# EAGLE design transponder-5.0 (EAGLE 9.6.1)

## Sheet 1 of 7
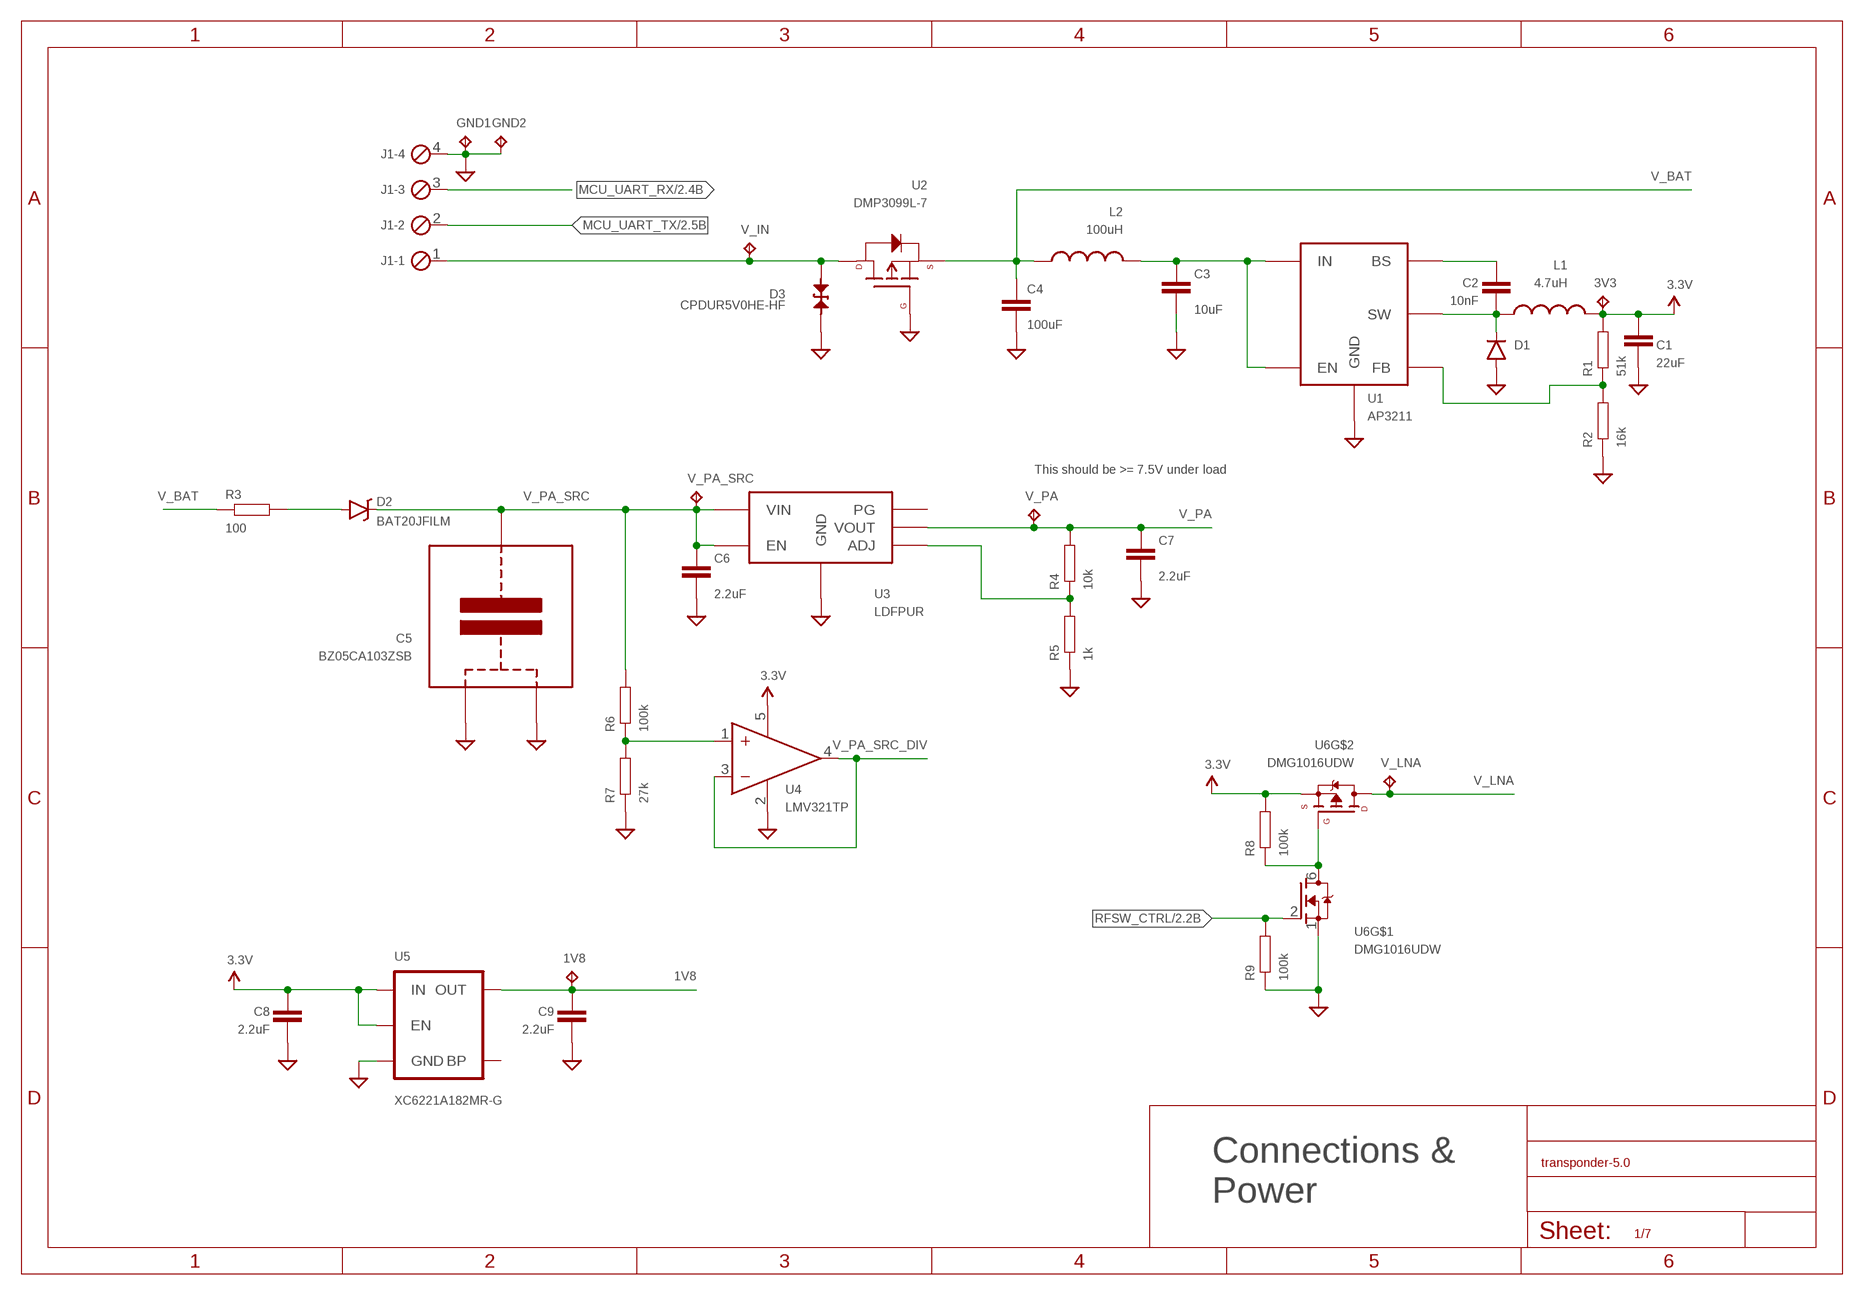
[diagram p0: schematic, sheet 1]

### Parts
1V8  TPTP12R  [TP12R]
3V3  TPTP12R  [TP12R]
C1  22uF  CAP0805  [0805]
C2  10nF  CAP0603-CAP  [0603-CAP]
C3  10uF  CAP0805  [0805]
C4  100uF  CAP1210  [1210]
C5  BZ05CA103ZSB  [BZ05]
C6  2.2uF  CAP0603-CAP  [0603-CAP]
C7  2.2uF  CAP0603-CAP  [0603-CAP]
C8  2.2uF  CAP0603-CAP  [0603-CAP]
C9  2.2uF  CAP0603-CAP  [0603-CAP]
D1  DIODESOD123  [SOD-123]
D2  BAT20JFILM  [SOD-323]
D3  CPDUR5V0HE-HF  [0603]
GND1  TPTP12R  [TP12R]
GND2  TPTP12R  [TP12R]
J1  MPT4  [4POL254]
L1  4.7uH  INDUCTOR0805  [0805]
L2  100uH  INDUCTOR1007  [1007]
R1  51k  RESISTOR0603-RES  [0603-RES]
R2  16k  RESISTOR0603-RES  [0603-RES]
R3  100  RESISTOR0603-RES  [0603-RES]
R4  10k  RESISTOR0603-RES  [0603-RES]
R5  1k  RESISTOR0603-RES  [0603-RES]
R6  100k  RESISTOR0603-RES  [0603-RES]
R7  27k  RESISTOR0603-RES  [0603-RES]
R8  100k  RESISTOR0603-RES  [0603-RES]
R9  100k  RESISTOR0603-RES  [0603-RES]
U1  AP3211  [SOT23-6]
U2  DMP3099L-7  P-CHANNEL-MOSFET  [SOT23-3]
U3  LDFPUR  LDF  [DFN-6]
U4  LMV321TP  [SOT23-5]
U5  XC6221A182MR-G  V_REG_LDOSMD  [SOT23-5]
U6  DMG1016UDW  [SOT363]
V_IN  TPTP12R  [TP12R]
V_LNA  TPTP12R  [TP12R]
V_PA  TPTP12R  [TP12R]
V_PA_SRC  TPTP12R  [TP12R]

### Nets
1V8: 1V8.TP C9.1 U5.5(OUT) ; also sheet 6
3.3V: 3V3.TP C1.1 C8.1 L1.2 R1.2 R8.2 U4.5(V+) U5.1(IN) U5.3(EN) U6.4(S) ; also sheet 2,4,6,7
GND: C1.2 C3.2 C4.2 C5.P$1 C5.P$2 C6.2 C7.2 C8.2 C9.2 D1.A D3.2 GND1.TP GND2.TP J1.4 R2.1 R5.1 R7.1 R9.1 U1.2(GND) U2.1(G) U3.P$4(GND) U3.P$7(GND) U4.2(V-) U5.2(GND) U6.1(S) ; also sheet 2,3,4,5,6,7
MCU_UART_RX: J1.3 ; also sheet 2
MCU_UART_TX: J1.2 ; also sheet 2
N$1: C3.1 L2.2 U1.4(EN) U1.5(IN)
N$2: C2.2 D1.C L1.1 U1.6(SW)
N$3: D2.A R3.2
N$4: C2.1 U1.1(BS)
N$5: R1.1 R2.2 U1.3(FB)
N$6: R8.1 U6.5(G) U6.6(D)
N$7: R6.1 R7.2 U4.1(IN+)
N$9: R4.1 R5.2 U3.P$2(ADJ)
RFSW_CTRL: R9.2 U6.2(G) ; also sheet 2,7
V_BAT: C4.1 L2.1 R3.1 U2.2(S)
V_IN: D3.1 J1.1 U2.3(D) V_IN.TP
V_LNA: U6.3(D) V_LNA.TP ; also sheet 3
V_PA: C7.1 R4.2 U3.P$1(VOUT) V_PA.TP ; also sheet 5
V_PA_SRC: C5.P$3 C6.1 D2.C R6.2 U3.P$5(EN) U3.P$6(VIN) V_PA_SRC.TP
V_PA_SRC_DIV: U4.3(IN-) U4.4(OUT) ; also sheet 2
Unconnected: U3.P$3(PG) U5.4(BP)

### Notes on the sheet
- This should be >= 7.5V under load
- Connections &
  Power

## Sheet 2 of 7
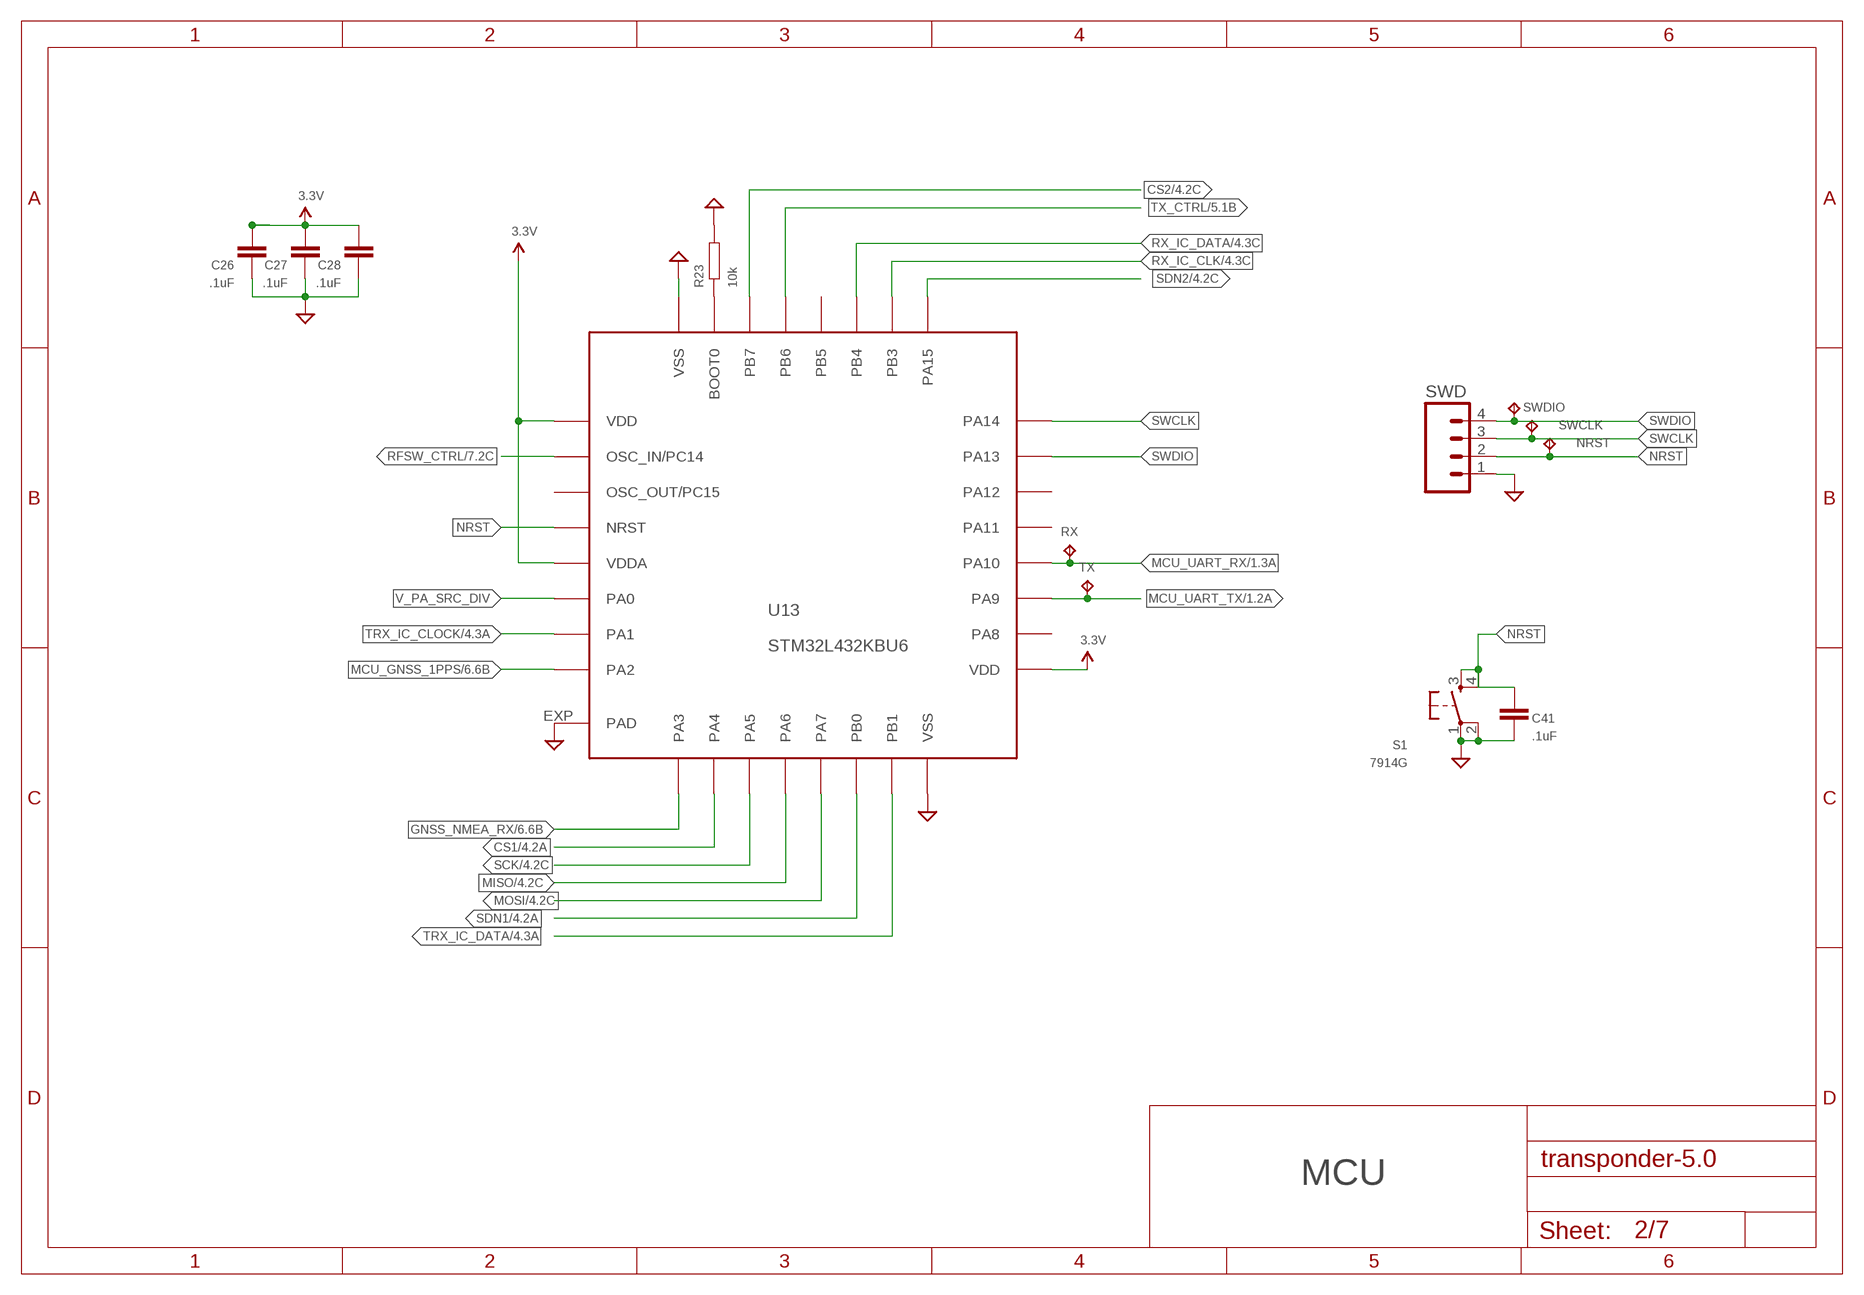
[diagram p1: schematic, sheet 2]

### Parts
C26  .1uF  CAP0603-CAP  [0603-CAP]
C27  .1uF  CAP0603-CAP  [0603-CAP]
C28  .1uF  CAP0603-CAP  [0603-CAP]
C41  .1uF  CAP0603-CAP  [0603-CAP]
NRST  TPTP12R  [TP12R]
R23  10k  RESISTOR0603-RES  [0603-RES]
RX  TPTP12R  [TP12R]
S1  7914G  TACTILE-SWITCH-7914G  [7914G]
SWCLK  TPTP12R  [TP12R]
SWD  M04PTH  [1X04]
SWDIO  TPTP12R  [TP12R]
TX  TPTP12R  [TP12R]
U13  STM32L432KBU6  STM32L432KXXX  [QFN32]

### Nets
3.3V: C26.1 C27.1 C28.1 U13.1(VDD) U13.5(VDDA) U13.17(VDD) ; also sheet 1,4,6,7
CS1: U13.10(PA4) ; also sheet 4
CS2: U13.30(PB7) ; also sheet 4
GND: C26.2 C27.2 C28.2 C41.2 R23.2 S1.1 S1.2 SWD.1 U13.16(VSS) U13.32(VSS) U13.EXP(PAD) ; also sheet 1,3,4,5,6,7
GNSS_NMEA_RX: U13.9(PA3) ; also sheet 6
MCU_GNSS_1PPS: U13.8(PA2) ; also sheet 6
MCU_UART_RX: RX.TP U13.20(PA10) ; also sheet 1
MCU_UART_TX: TX.TP U13.19(PA9) ; also sheet 1
MISO: U13.12(PA6) ; also sheet 4
MOSI: U13.13(PA7) ; also sheet 4
N$36: R23.1 U13.31(BOOT0)
NRST: C41.1 NRST.TP S1.3 S1.4 SWD.2 U13.4(NRST)
RFSW_CTRL: U13.2(OSC_IN/PC14) ; also sheet 1,7
RX_IC_CLK: U13.26(PB3) ; also sheet 4
RX_IC_DATA: U13.27(PB4) ; also sheet 4
SCK: U13.11(PA5) ; also sheet 4
SDN1: U13.14(PB0) ; also sheet 4
SDN2: U13.25(PA15) ; also sheet 4
SWCLK: SWCLK.TP SWD.3 U13.24(PA14)
SWDIO: SWD.4 SWDIO.TP U13.23(PA13)
TRX_IC_CLOCK: U13.7(PA1) ; also sheet 4
TRX_IC_DATA: U13.15(PB1) ; also sheet 4
TX_CTRL: U13.29(PB6) ; also sheet 5
V_PA_SRC_DIV: U13.6(PA0) ; also sheet 1
Unconnected: U13.3(OSC_OUT/PC15) U13.18(PA8) U13.21(PA11) U13.22(PA12) U13.28(PB5)

### Notes on the sheet
- MCU

## Sheet 3 of 7
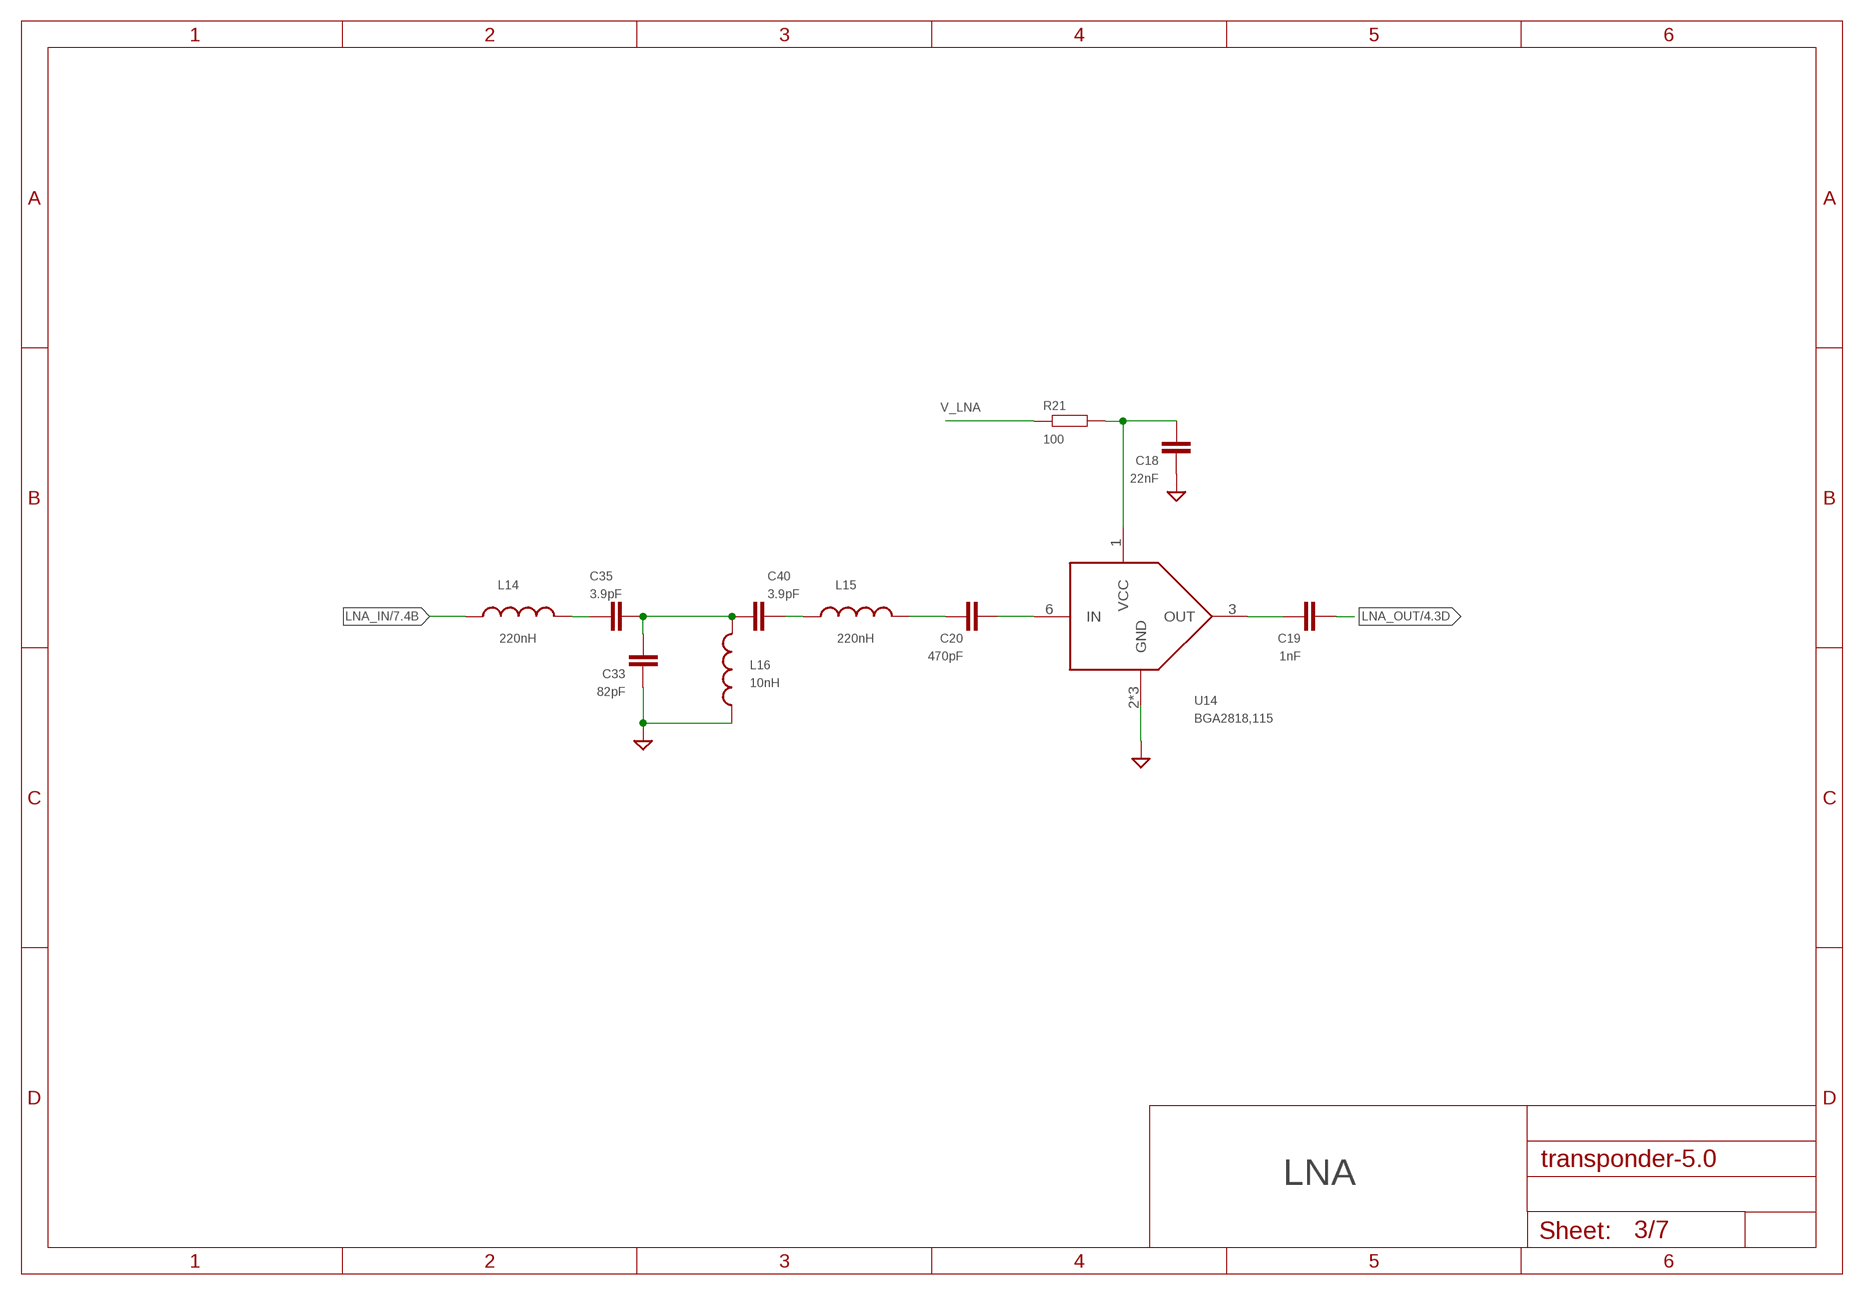
[diagram p2: schematic, sheet 3]

### Parts
C18  22nF  CAP0603-CAP  [0603-CAP]
C19  1nF  CAP0603-CAP  [0603-CAP]
C20  470pF  CAP0603-CAP  [0603-CAP]
C33  82pF  CAP0603-CAP  [0603-CAP]
C35  3.9pF  CAP0603-CAP  [0603-CAP]
C40  3.9pF  CAP0603-CAP  [0603-CAP]
L14  220nH  INDUCTOR0603  [0603]
L15  220nH  INDUCTOR0603  [0603]
L16  10nH  INDUCTOR0603  [0603]
R21  100  RESISTOR0603-RES  [0603-RES]
U14  BGA2818,115  BGA2870  [SOT363]

### Nets
GND: C18.2 C33.1 L16.1 U14.2(GND) U14.4(GND) U14.5(GND) ; also sheet 1,2,4,5,6,7
LNA_IN: L14.1 ; also sheet 7
LNA_OUT: C19.2 ; also sheet 4
N$20: C20.2 U14.6(IN)
N$22: C18.1 R21.2 U14.1(VCC)
N$37: C33.2 C35.1 C40.2 L16.2
N$38: C40.1 L15.1
N$39: C35.2 L14.2
N$40: C20.1 L15.2
N$41: C19.1 U14.3(OUT)
V_LNA: R21.1 ; also sheet 1

### Notes on the sheet
- LNA

## Sheet 4 of 7
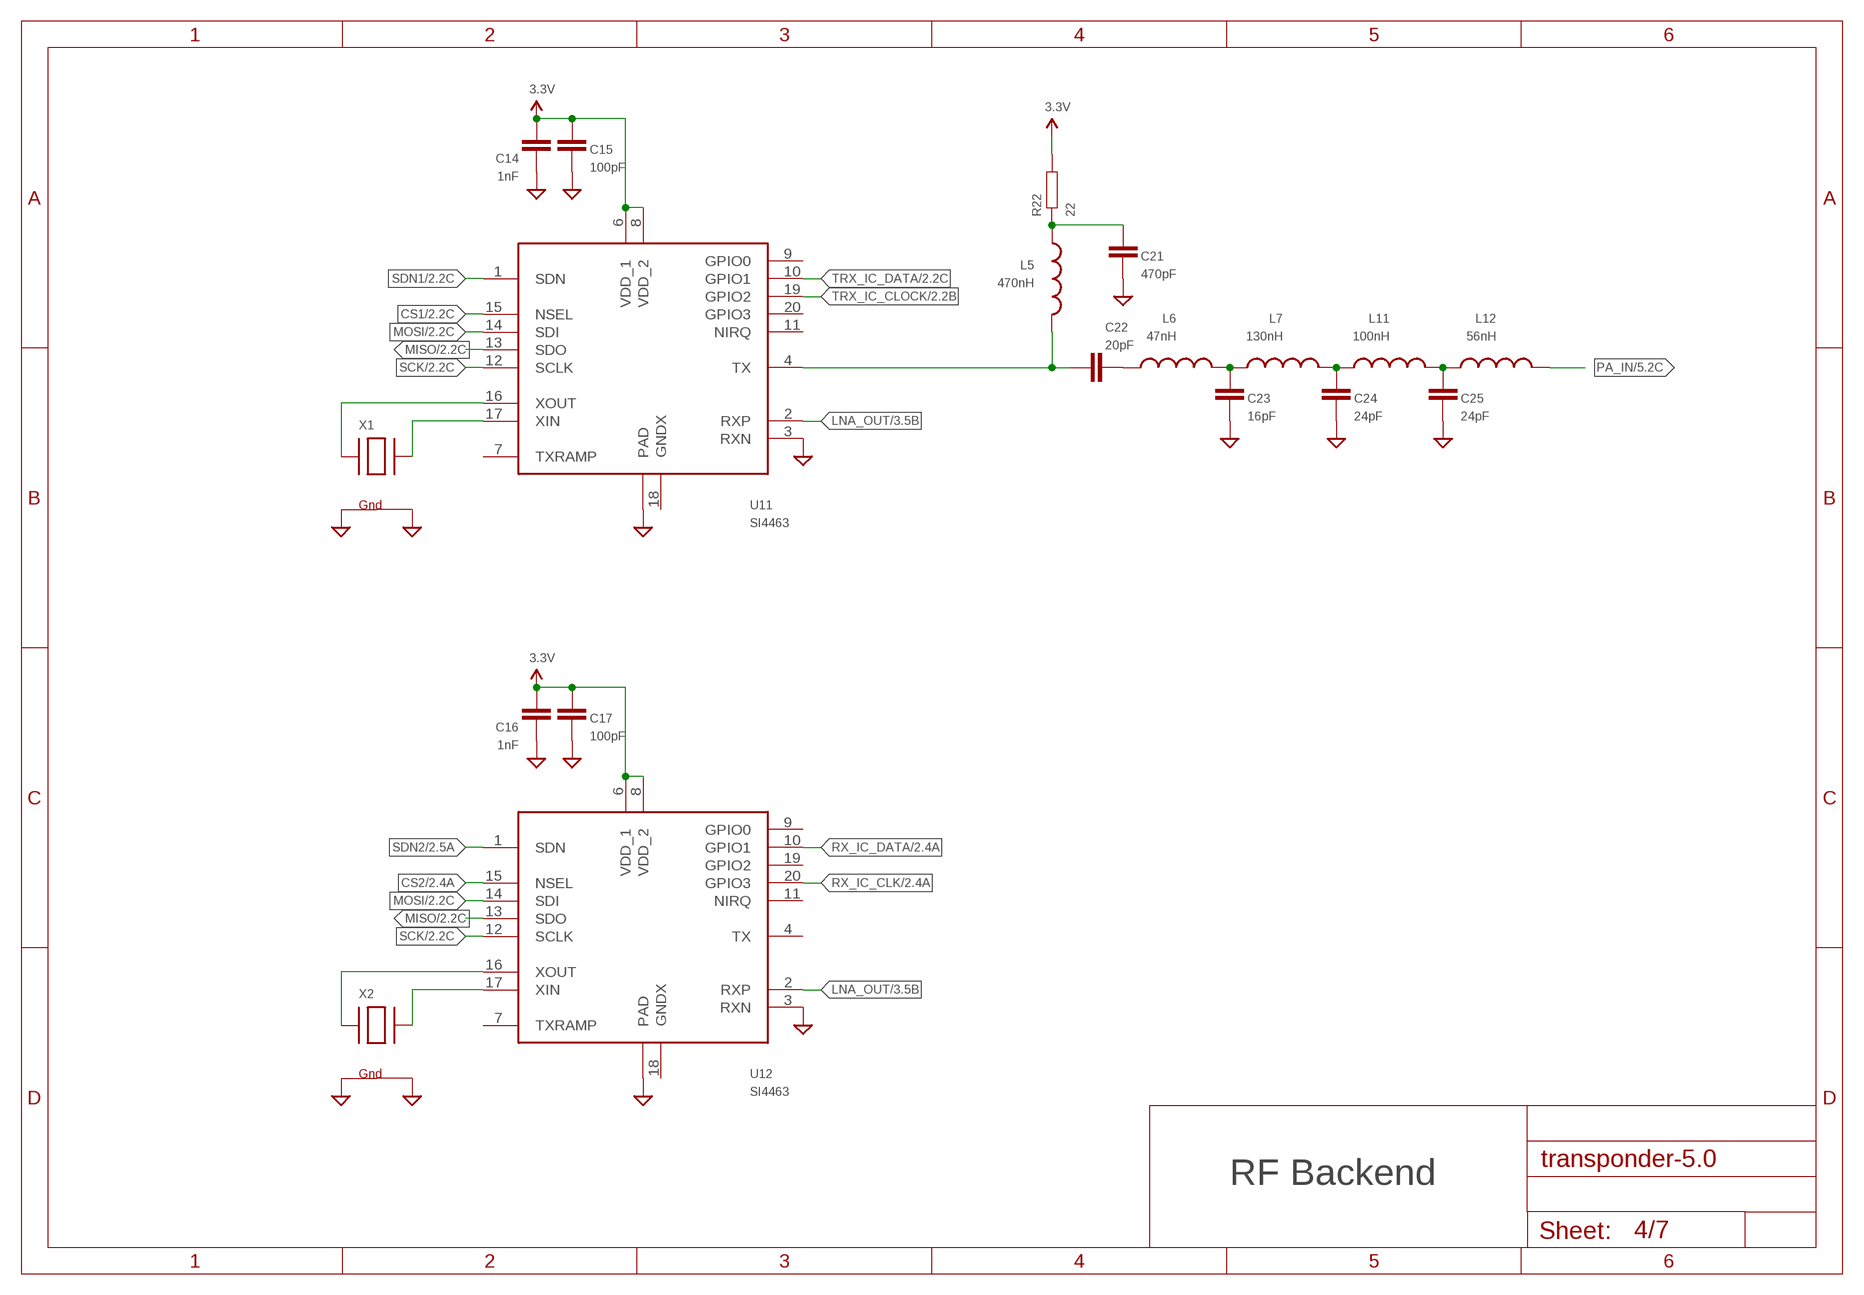
[diagram p3: schematic, sheet 4]

### Parts
C14  1nF  CAP0603-CAP  [0603-CAP]
C15  100pF  CAP0603-CAP  [0603-CAP]
C16  1nF  CAP0603-CAP  [0603-CAP]
C17  100pF  CAP0603-CAP  [0603-CAP]
C21  470pF  CAP0603-CAP  [0603-CAP]
C22  20pF  CAP0603-CAP  [0603-CAP]
C23  16pF  CAP0603-CAP  [0603-CAP]
C24  24pF  CAP0603-CAP  [0603-CAP]
C25  24pF  CAP0603-CAP  [0603-CAP]
L5  470nH  INDUCTOR0603  [0603]
L6  47nH  INDUCTOR0603  [0603]
L7  130nH  INDUCTOR0603  [0603]
L11  100nH  INDUCTOR0603  [0603]
L12  56nH  INDUCTOR0603  [0603]
R22  22  RESISTOR0603-RES  [0603-RES]
U11  SI4463  [SI4463]
U12  SI4463  [SI4463]
X1  XTAL-4-3225  [NX3225]
X2  XTAL-4-3225  [NX3225]

### Nets
3.3V: C14.1 C15.1 C16.1 C17.1 R22.2 U11.6(VDD_1) U11.8(VDD_2) U12.6(VDD_1) U12.8(VDD_2) ; also sheet 1,2,6,7
CS1: U11.15(NSEL) ; also sheet 2
CS2: U12.15(NSEL) ; also sheet 2
GND: C14.2 C15.2 C16.2 C17.2 C21.2 C23.2 C24.2 C25.2 U11.3(RXN) U11.EXP(PAD) U12.3(RXN) U12.EXP(PAD) X1.2(G2) X1.4(G1) X2.2(G2) X2.4(G1) ; also sheet 1,2,3,5,6,7
LNA_OUT: U11.2(RXP) U12.2(RXP) ; also sheet 3
MISO: U11.13(SDO) U12.13(SDO) ; also sheet 2
MOSI: U11.14(SDI) U12.14(SDI) ; also sheet 2
N$16: U12.16(XOUT) X2.1(X1)
N$17: U12.17(XIN) X2.3(X2)
N$18: U11.16(XOUT) X1.1(X1)
N$19: U11.17(XIN) X1.3(X2)
N$24: C22.1 L5.2 U11.4(TX)
N$30: C21.1 L5.1 R22.1
N$31: C22.2 L6.1
N$32: C23.1 L6.2 L7.1
N$33: C24.1 L7.2 L11.1
N$34: C25.1 L11.2 L12.1
PA_IN: L12.2 ; also sheet 5
RX_IC_CLK: U12.20(GPIO3) ; also sheet 2
RX_IC_DATA: U12.10(GPIO1) ; also sheet 2
SCK: U11.12(SCLK) U12.12(SCLK) ; also sheet 2
SDN1: U11.1(SDN) ; also sheet 2
SDN2: U12.1(SDN) ; also sheet 2
TRX_IC_CLOCK: U11.19(GPIO2) ; also sheet 2
TRX_IC_DATA: U11.10(GPIO1) ; also sheet 2
Unconnected: U11.7(TXRAMP) U11.9(GPIO0) U11.11(NIRQ) U11.18(GNDX) U11.20(GPIO3) U12.4(TX) U12.7(TXRAMP) U12.9(GPIO0) U12.11(NIRQ) U12.18(GNDX) U12.19(GPIO2)

### Notes on the sheet
- RF Backend

## Sheet 5 of 7
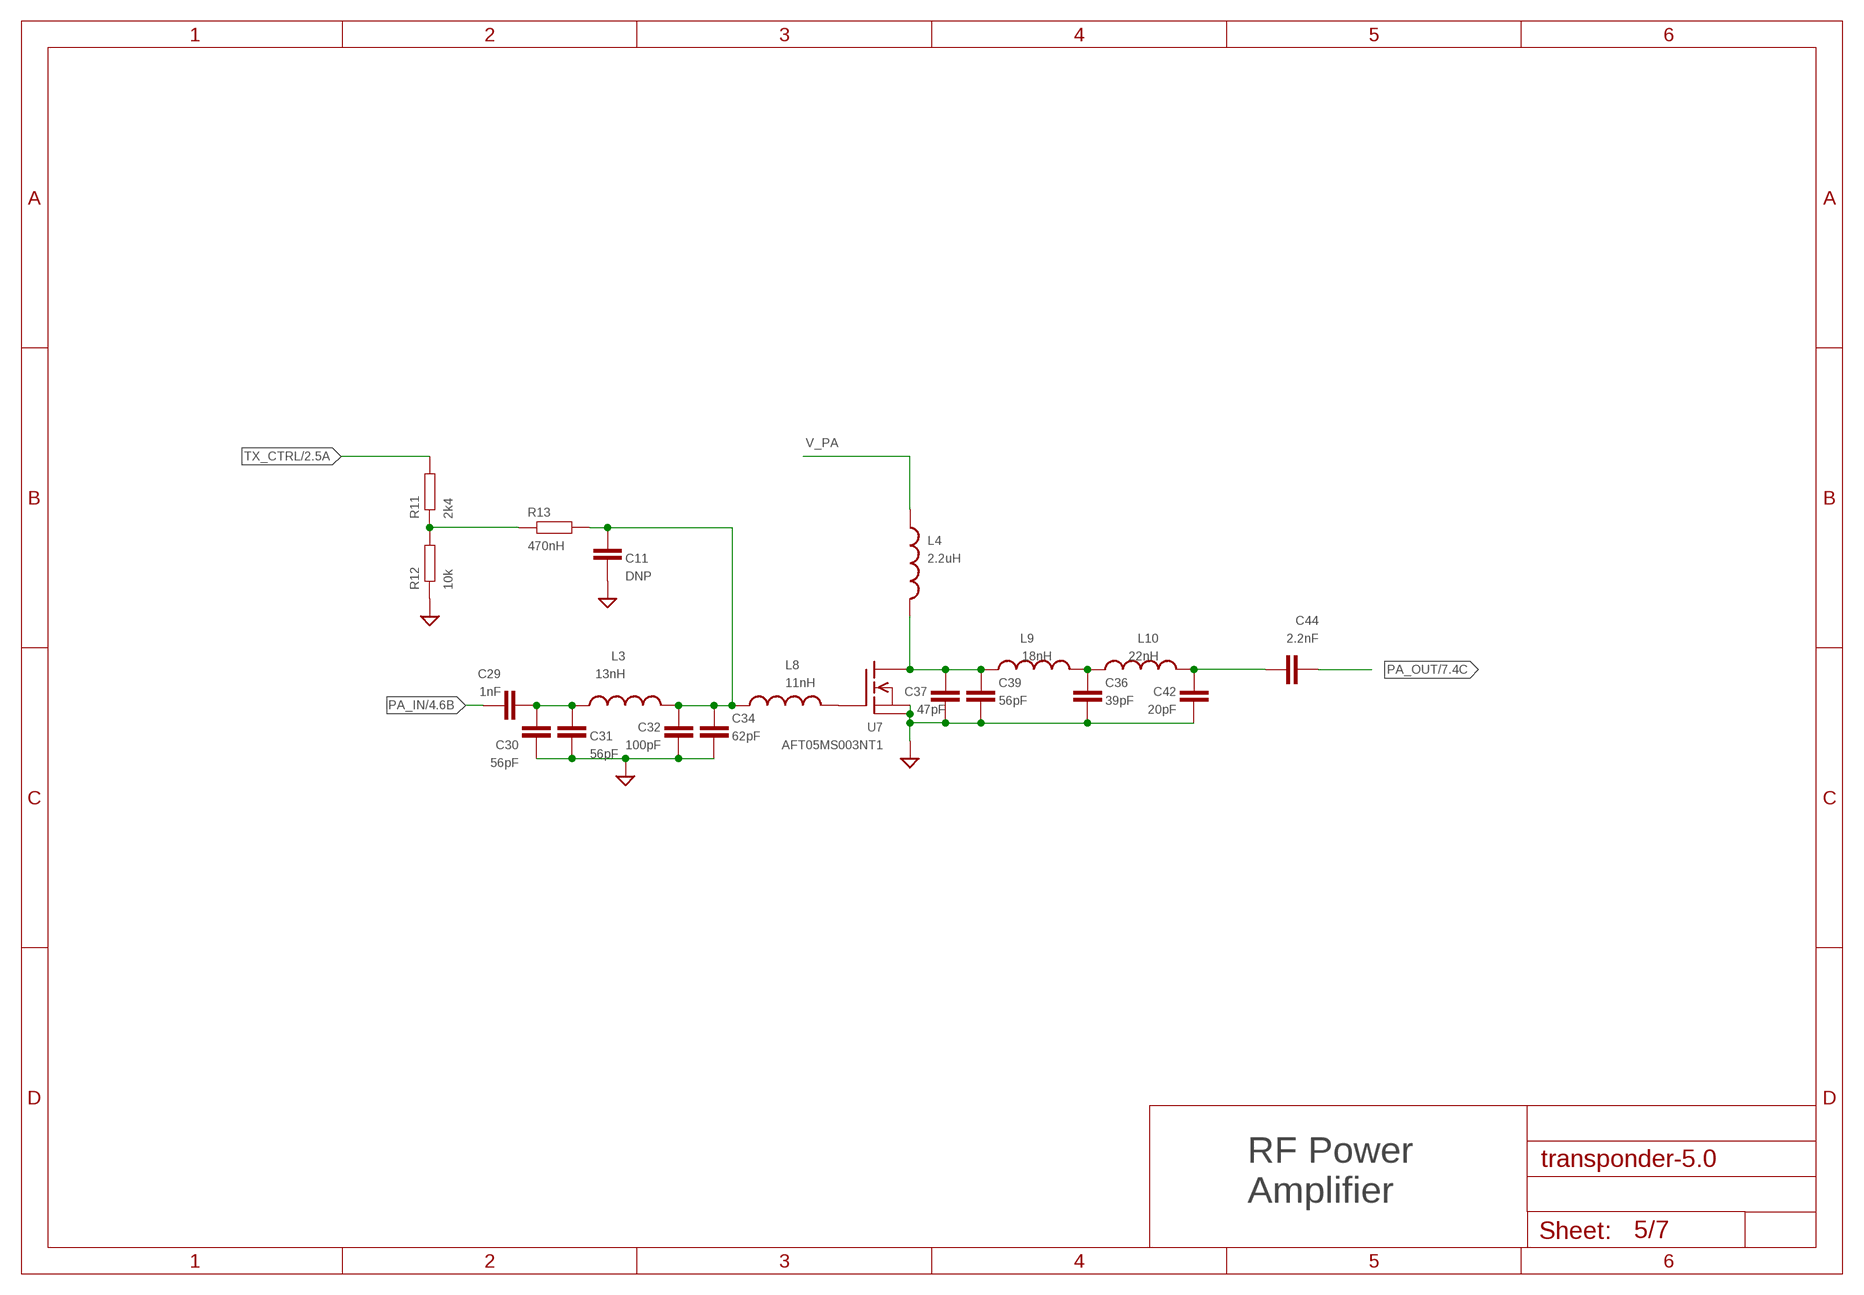
[diagram p4: schematic, sheet 5]

### Parts
C11  DNP  CAP0603-CAP  [0603-CAP]
C29  1nF  CAP0603-CAP  [0603-CAP]
C30  56pF  CAP0603-CAP  [0603-CAP]
C31  56pF  CAP0603-CAP  [0603-CAP]
C32  100pF  CAP0603-CAP  [0603-CAP]
C34  62pF  CAP0603-CAP  [0603-CAP]
C36  39pF  CAP0805  [0805]
C37  47pF  CAP0805  [0805]
C39  56pF  CAP0805  [0805]
C42  20pF  CAP0805  [0805]
C44  2.2nF  CAP0805  [0805]
L3  13nH  INDUCTOR0603  [0603]
L4  2.2uH  INDUCTOR0805  [0805]
L8  11nH  INDUCTOR0603  [0603]
L9  18nH  INDUCTOR0805  [0805]
L10  22nH  INDUCTOR0805  [0805]
R11  2k4  RESISTOR0603-RES  [0603-RES]
R12  10k  RESISTOR0603-RES  [0603-RES]
R13  470nH  RESISTOR0603-RES  [0603-RES]
U7  AFT05MS003NT1  AFT0SMS003N  [SOT-89]

### Nets
GND: C11.2 C30.2 C31.2 C32.2 C34.2 C36.2 C37.2 C39.2 C42.2 R12.1 U7.2(S) U7.2@1(PAD) ; also sheet 1,2,3,4,6,7
N$8: R11.1 R12.2 R13.1
N$23: C37.1 C39.1 L4.2 L9.1 U7.3(D)
N$25: L8.2 U7.1(G)
N$26: C11.1 C32.1 C34.1 L3.2 L8.1 R13.2
N$27: C29.2 C30.1 C31.1 L3.1
N$28: C36.1 L9.2 L10.1
N$43: C42.1 C44.1 L10.2
PA_IN: C29.1 ; also sheet 4
PA_OUT: C44.2 ; also sheet 7
TX_CTRL: R11.2 ; also sheet 2
V_PA: L4.1 ; also sheet 1

### Notes on the sheet
- RF Power
  Amplifier

## Sheet 6 of 7
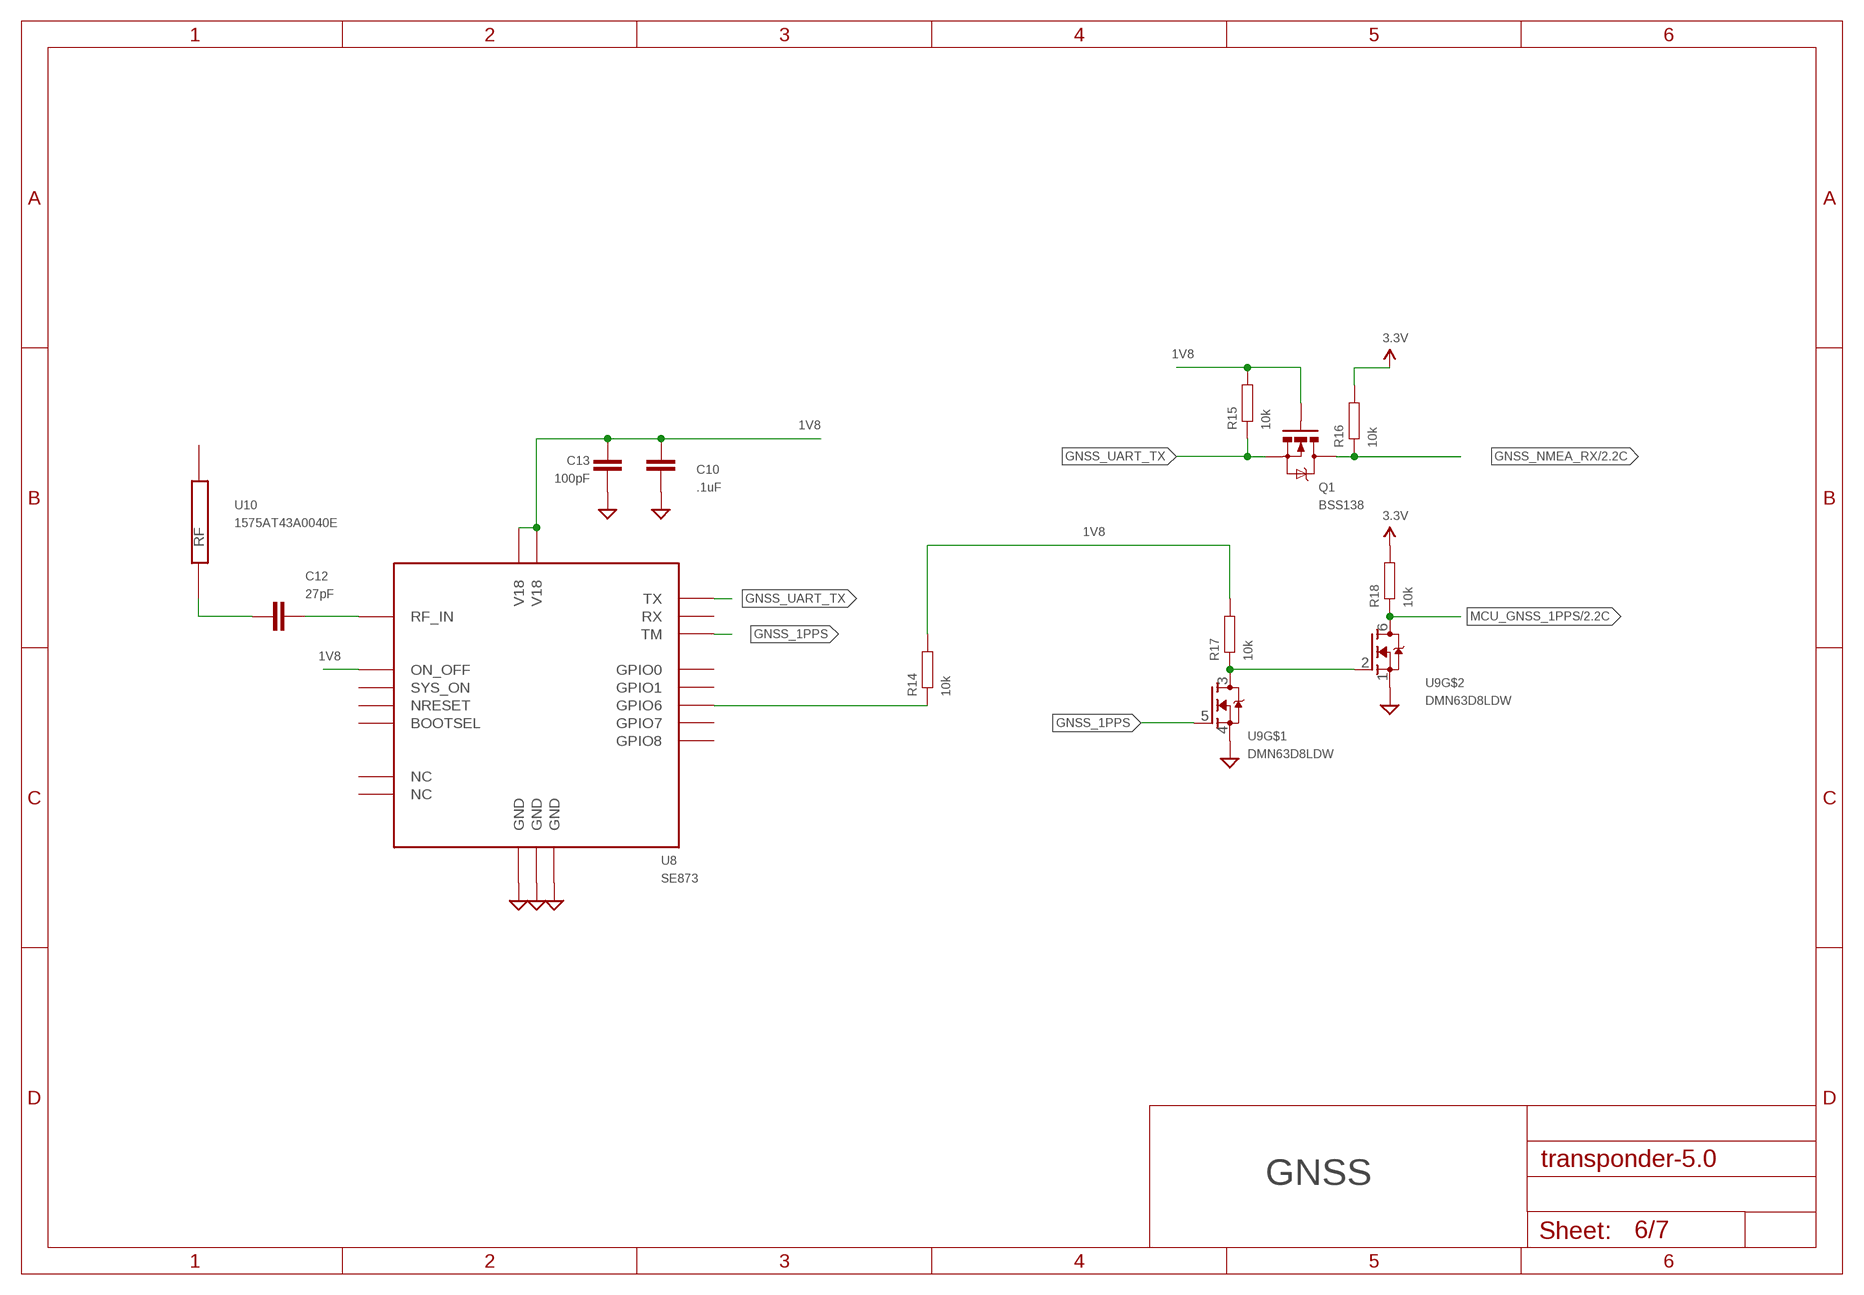
[diagram p5: schematic, sheet 6]

### Parts
C10  .1uF  CAP0603-CAP  [0603-CAP]
C12  27pF  CAP0603-CAP  [0603-CAP]
C13  100pF  CAP0603-CAP  [0603-CAP]
Q1  BSS138  MOSFET-NCHANNELBSS138  [SOT23-3]
R14  10k  RESISTOR0603-RES  [0603-RES]
R15  10k  RESISTOR0603-RES  [0603-RES]
R16  10k  RESISTOR0603-RES  [0603-RES]
R17  10k  RESISTOR0603-RES  [0603-RES]
R18  10k  RESISTOR0603-RES  [0603-RES]
U8  SE873  [SE873]
U9  DMN63D8LDW  [SOT363]
U10  1575AT43A0040E  [1575AT43A0040E]

### Nets
1V8: C10.1 C13.1 Q1.1(G) R14.2 R15.2 R17.2 U8.P$3(V18) U8.P$6(ON_OFF) U8.P$19(V18) ; also sheet 1
3.3V: R16.2 R18.2 ; also sheet 1,2,4,7
GND: C10.2 C13.2 U8.P$2(GND) U8.P$10(GND) U8.P$20(GND) U9.1(S) U9.4(S) ; also sheet 1,2,3,4,5,7
GNSS_1PPS: U8.P$11(TM) U9.5(G)
GNSS_NMEA_RX: Q1.3(D) R16.1 ; also sheet 2
GNSS_UART_TX: Q1.2(S) R15.1 U8.P$15(TX)
MCU_GNSS_1PPS: R18.1 U9.6(D) ; also sheet 2
N$10: C12.2 U8.P$1(RF_IN)
N$11: C12.1 U10.P$1(RF)
N$12: R17.1 U9.2(G) U9.3(D)
N$13: R14.1 U8.P$13(GPIO6)
Unconnected: U8.P$4(NC) U8.P$5(GPIO8) U8.P$7(SYS_ON) U8.P$8(NRESET) U8.P$9(BOOTSEL) U8.P$12(GPIO7) U8.P$14(RX) U8.P$16(NC) U8.P$17(GPIO1) U8.P$18(GPIO0) U10.P$2(PAD)

### Notes on the sheet
- GNSS

## Sheet 7 of 7
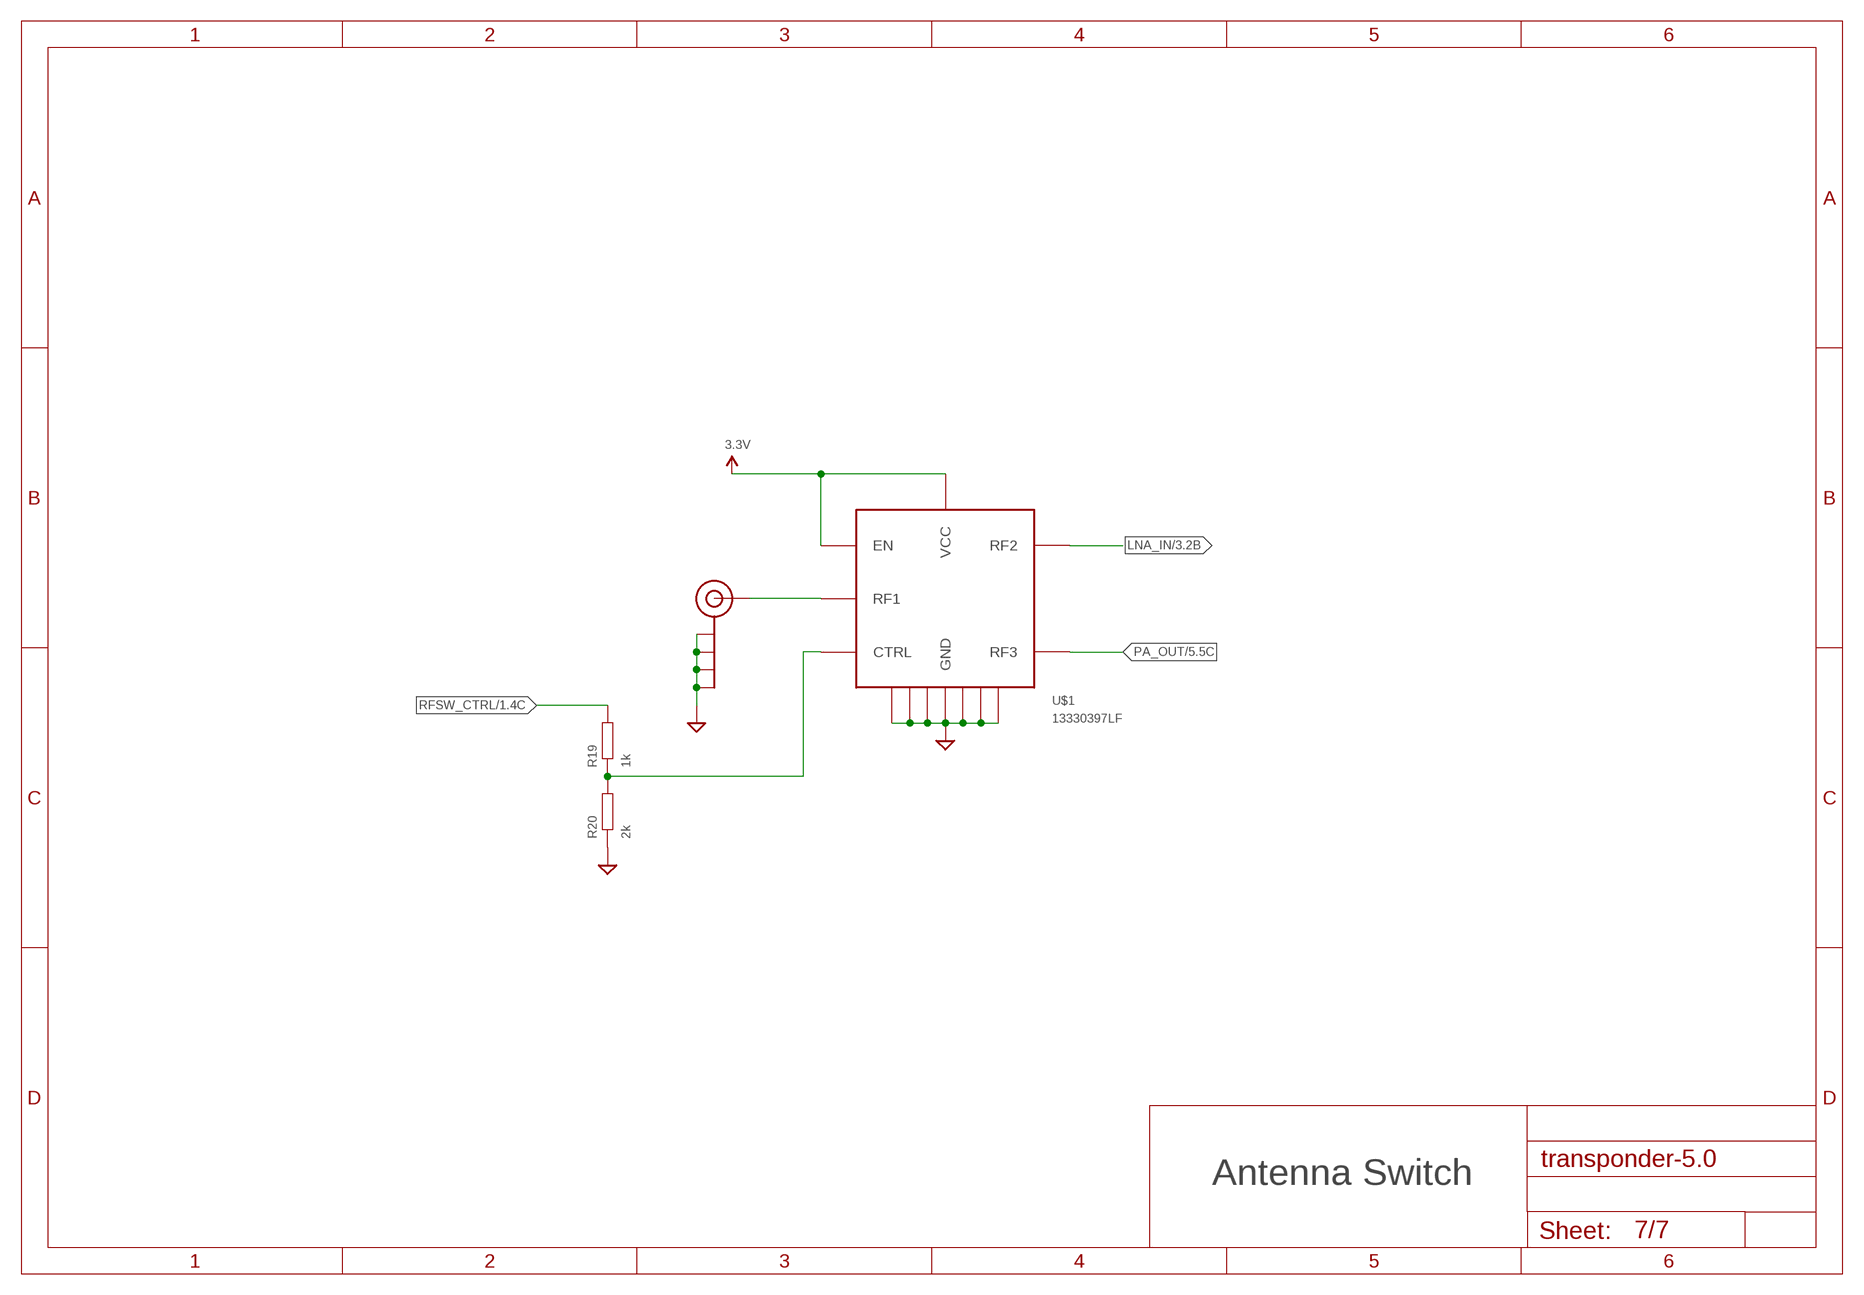
[diagram p6: schematic, sheet 7]

### Parts
J$1  SMA_EDGE  [SMA-EDGE]
R19  1k  RESISTOR0603-RES  [0603-RES]
R20  2k  RESISTOR0603-RES  [0603-RES]
U$1  13330397LF  SKYWORKS-13330397LF  [QFN12]

### Nets
3.3V: U$1.P$8(EN) U$1.P$9(VCC) ; also sheet 1,2,4,6
GND: J$1.GND@0(GND) J$1.GND@1(GND) J$1.GND@2(GND) J$1.GND@3(GND) R20.1 U$1.P$1(GND) U$1.P$3(GND) U$1.P$4(GND) U$1.P$6(GND) U$1.P$10(GND) U$1.P$12(GND) U$1.P$13(GND) ; also sheet 1,2,3,4,5,6
LNA_IN: U$1.P$11(RF2) ; also sheet 3
N$14: R19.1 R20.2 U$1.P$7(CTRL)
N$15: J$1.SIG(SIGNAL) U$1.P$2(RF1)
PA_OUT: U$1.P$5(RF3) ; also sheet 5
RFSW_CTRL: R19.2 ; also sheet 1,2

### Notes on the sheet
- Antenna Switch

## Library data of the parts
1V8 3V3 GND1 GND2 NRST RX SWCLK SWDIO TX V_IN V_LNA V_PA V_PA_SRC = testpad:TP: Test pad
C1-C4 C6-C37 C39-C42 C44 = SparkFun-Capacitors:CAP: Capacitor Standard 0603 ceramic capacitor, and 0.1" leaded capacitor.
C5 = avx-supercaps:BZ05CA103ZSB: AVX BestCap Supercapacitor
D1 = SparkFun-DiscreteSemi:DIODE: Diode These are standard reverse protection diodes and small signal diodes. SMA package can handle up to about 1A. SOD-323 can handle about 200mA. What the SOD-323 package when ordering, there are some mfgs out there that are 5-pin packages.
D2 = SparkFun-DiscreteSemi:BAT20JFILM: 23V, 1A Schottky diode, SOD-323 package; PROD_ID: DIO-11623
D3 = comchip:CPDUR5V0HE-HF: TVS DIODE 5VWM 16VC 0603
J1 = con-phoenix-254:MPT4: PHOENIX CONNECTOR; OC_FARNELL: unknown; OC_NEWARK: unknown
J$1 = SparkFun-Connectors:SMA_EDGE: SMA Antenna Connector End launch SMA connector. The paste layer has been removed so that the connector can be hand soldered onto the board after reflow.
L1-L12 L14-L16 = SparkFun-Passives:INDUCTOR: Inductors Basic Inductor/Choke - 0603 and 1206. Footprints are not proven and vary greatly between part numbers. INDUCTOR POWER 3.3UH 4.0A SMD 0.197" L x 0.197" W x 0.177" H (5.00mm x 5.00mm x 4.50mm)
Q1 = SparkFun-DiscreteSemi:MOSFET-NCHANNEL: Common NMOSFET Parts MFG P/N Store ID Prod ID FDD8780 TRANS-09984 SI7820DN TRANS-11055 FDS6630A IC-08089 2N7002PW TRANS-11151 FQP30N06L COM-10213 TRANS-10060 BSS123LT1G TRANS-08345 BSS138 TRANS-00830 BS170 2N7000; PROD_ID: TRANS-00830; VALUE: 200mA/50V
R1-R9 R11-R23 = SparkFun-Passives:RESISTOR: Resistor Basic schematic elements and footprints for 0603, 1206, and PTH resistors.
S1 = GeekAmmo:TACTILE-SWITCH: Tactile Switch 4 Pins, SPST NO
SWD = SparkFun-Connectors:M04: Header 4 Standard 4-pin 0.1" header. Use with straight break away headers (SKU : PRT-00116), right angle break away headers (PRT-00553), swiss pins (PRT-00743), machine pins (PRT-00117), and female headers (PRT-00115). Molex polarized connector foot print use with SKU : PRT-08231 with associated crimp pins and housings. 1MM SMD Version SKU: PRT-10208
U1 = diodesinc:AP3211
U2 = GeekAmmo:P-CHANNEL-MOSFET: P-Channel MOSFET Mode Field Effect Transistor
U3 = st-power:LDF: Low Noise Adjustable LDO (1A max)
U4 = 3peak:LMV321TP: Rail to rail op amp
U5 = SparkFun-PowerIC:V_REG_LDO: Voltage Regulator LDO Standard 150mA LDO voltage regulator in SOT-23 layout. Micrel part MIC5205. BP (by-pass) pin is used to lower output noise with 470pF cap.
U6 = diodesinc:DMG1016UDW: N/P Channel MOSFET pair
U7 = nxp:AFT0SMS003N
U8 = telit:SE873: Telit SE873 GNSS Receiver
U9 = diodesinc:DMN63D8LDW: Dual N-Channel MOSFET
U10 = johanson-technology:1575AT43A0040E: SMD Ceramic GNSS Antenna
U11 U12 = EZRadioPRO:SI4463
U13 = stm32:STM32L432KXXX
U14 = nxp:BGA2870: MMIC Wideband Amplifier
U$1 = skyworks:SKYWORKS-13330397LF: SP2T RF Switch
X1 X2 = adafruit:XTAL-4: Classic 4-pin 3.2 x 2.5mm crystal

## Board
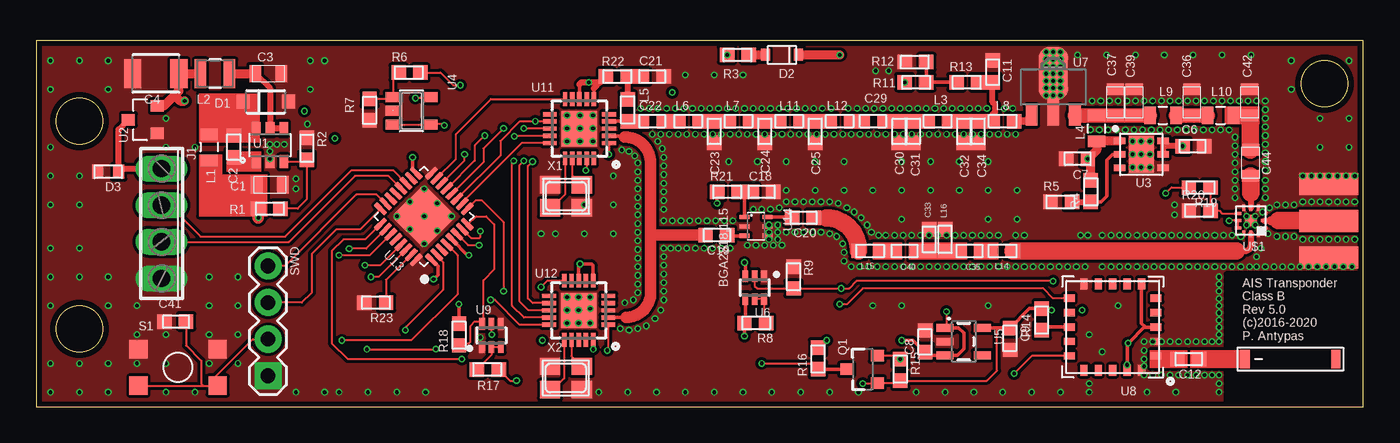
[diagram p7: board, top side]
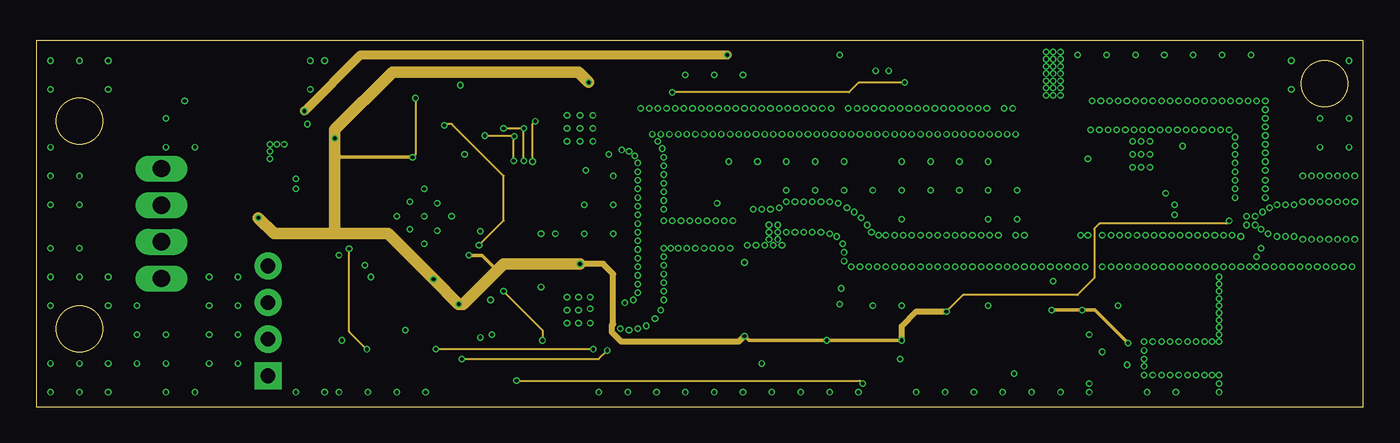
[diagram p8: board, inner layer Layer2]
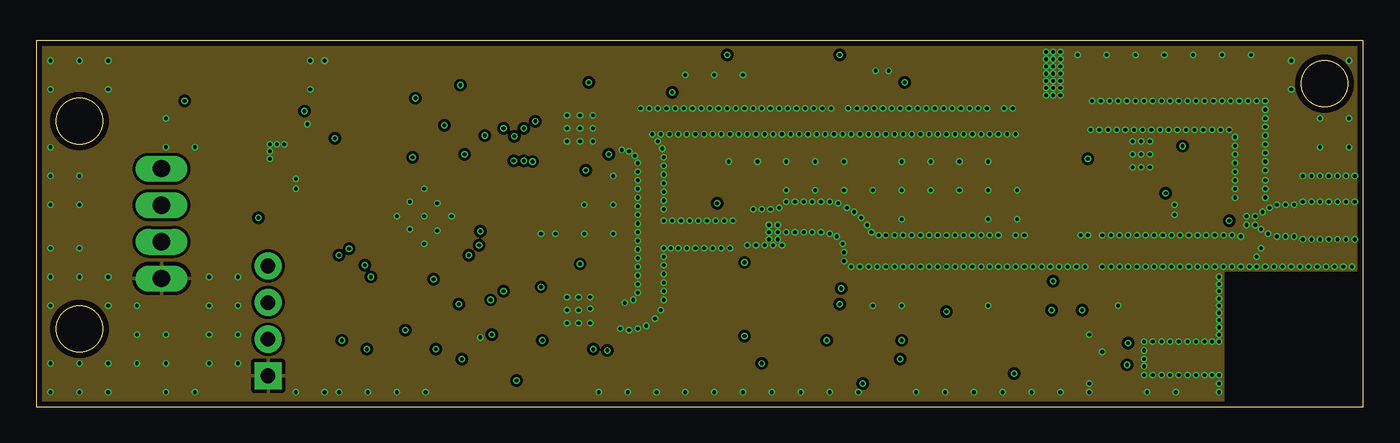
[diagram p9: board, inner layer Layer3]
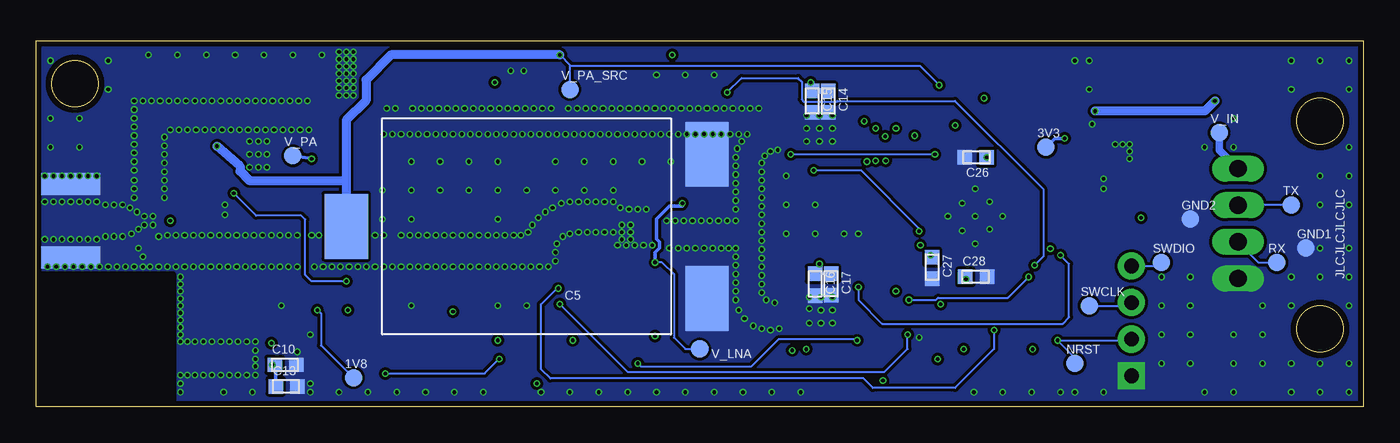
[diagram p10: board, bottom side, seen from below]

Size 92 x 25.4 mm. Coordinates in mm from the lower left corner, seen from the top.
Outline: 0,0 92,0 92,25.4 0,25.4 0,0
Outline: circle at 3,19.8 radius 1.6
Outline: circle at 3,5.4 radius 1.6
Outline: circle at 89.3,22.4 radius 1.6
Copper layers (1+2*15+16): Top 0.035mm / dielectric 0.17mm / Layer2 0.018mm / dielectric 1.2mm / Layer3 0.018mm / dielectric 0.17mm / Bottom 0.035mm
Design rules "default *": minimum track width 5mil, minimum drill 10mil, track to track 5mil, track to pad 5mil, pad to pad 5mil, via to via 5mil, smd to smd 0mil, copper to edge 15mil, drill to drill 6mil, minimum pad ring 4mil, minimum via ring 4mil, stop-mask expansion 0mil, vias tented up to drill 20mil, thermal gap 10mil
tRestrict: area 82.5,0 to 92,9.2
bRestrict: area 82.5,0 to 92,9.2

### Footprints (pad centres in the part's own frame; a part is rotated, then mirrored left to right if it is on the bottom)
TP12R = smd 1.2 x 1.2: TP 0,0
0805 = smd 0.8 x 1.2: 1 -0.9,0; 2 0.9,0
0603-CAP = smd 1 x 1: 1 -0.7,0; 2 0.8,0
1210 = smd 1.2 x 2: 1 -1.6,0; 2 1.6,0
BZ05 = smd 3 x 4.5: P$1 -12.5,5; P$2 -12.5,-5; P$3 12.5,0
SOD-123 = smd 0.9 x 0.95: A 1.575,0; C -1.575,0
SOD-323 = smd 0.63 x 0.83: A 1.15,0; C -1.15,0
0603 = smd 0.787 x 0.965: 1 -0.723,0; 2 0.723,0
4POL254 = drill 1.2 long: 1 -3.81,0; 2 -1.27,0; 3 1.27,0; 4 3.81,0
SMA-EDGE = smd 1.524 x 4.064: GND@0 0,0; GND@1 5.08,0; SIG 2.54,0 | smd 1.524 x 4.064 bottom: GND@2 0,0; GND@3 5.08,0
1007 = smd 2 x 0.8: 1 0,1; 2 0,-1
0603' = smd 1 x 1: 1 -0.7,0; 2 0.8,0
SOT23-3 = smd 0.8 x 0.9: 1 -0.95,-1; 2 0.95,-1; 3 0,1.1
0603-RES = smd 1 x 1: 1 -0.7,0; 2 0.8,0
7914G = smd 1.27 x 1.27: 1 0,0; 2 0,5.486; 3 2.54,0; 4 2.54,5.486
1X04 = drill 1.016 pad 1.88 square: 1 0,0 | drill 1.016 pad 1.88: 2 2.54,0; 3 5.08,0; 4 7.62,0
SOT23-6 = smd 0.6 x 0.9: 1 -0.95,-1.15; 2 0,-1.15; 3 0.95,-1.15; 4 0.95,1.15; 5 0,1.15; 6 -0.95,1.15
SOT23-3' = smd 0.8 x 0.9: 1 -0.95,-1; 2 0.95,-1; 3 0,1
DFN-6 = smd 0.8 x 0.45: P$1 -1.5,0.95; P$2 -1.5,0; P$3 -1.5,-0.95; P$4 1.5,-0.95; P$5 1.5,0; P$6 1.5,0.95 | smd 1.75 x 2.5: P$7 0,0
SOT23-5 = smd 0.69 x 0.99: 1 -0.95,-1.29; 2 0,-1.29; 3 0.95,-1.29; 4 0.95,1.3; 5 -0.95,1.3
SOT23-5' = smd 0.55 x 1.2: 1 -0.95,-1.3; 2 0,-1.3; 3 0.95,-1.3; 4 0.95,1.3; 5 -0.95,1.3
SOT363 = smd 0.4 x 0.8: 1 -0.65,-0.8; 2 0,-0.8; 3 0.65,-0.8; 4 0.65,0.8; 5 0,0.8; 6 -0.65,0.8
SOT-89 = smd 0.8 x 1.4: 1 -1.499,-1.981; 3 1.499,-1.981 | smd 0.8 x 1.9: 2 0,-1.727 | smd 2.032 x 3.65: 2@1 0,0.94
SE873 = smd 0.75 x 0.5: P$1 -3,2; P$2 -3,1; P$3 -3,0; P$4 -3,-1; P$5 -3,-2; P$11 3,-2; P$12 3,-1; P$13 3,0; P$14 3,1; P$15 3,2 | smd 0.5 x 0.75: P$6 -2,-3; P$7 -1,-3; P$8 0,-3; P$9 1,-3; P$10 2,-3; P$16 2,3; P$17 1,3; P$18 0,3; P$19 -1,3; P$20 -2,3
1575AT43A0040E = smd 0.635 x 1.27: P$1 -3.2,0; P$2 3.1,0
SI4463 = smd 0.95 x 0.3: 1 -2.05,1; 2 -2.05,0.5; 3 -2.05,0; 4 -2.05,-0.5; 5 -2.05,-1; 11 2.05,-1; 12 2.05,-0.5; 13 2.05,0; 14 2.05,0.5; 15 2.05,1 | smd 0.3 x 0.95: 6 -1,-2.05; 7 -0.5,-2.05; 8 0,-2.05; 9 0.5,-2.05; 10 1,-2.05; 16 1,2.05; 17 0.5,2.05; 18 0,2.05; 19 -0.5,2.05; 20 -1,2.05 | smd 2.45 x 2.45: EXP 0,0
QFN32 = smd 1 x 0.3: 1 -2.5,1.75; 2 -2.5,1.25; 3 -2.5,0.75; 4 -2.5,0.25; 5 -2.5,-0.25; 6 -2.5,-0.75; 7 -2.5,-1.25; 8 -2.5,-1.75; 17 2.5,-1.75; 18 2.5,-1.25; 19 2.5,-0.75; 20 2.5,-0.25; 21 2.5,0.25; 22 2.5,0.75; 23 2.5,1.25; 24 2.5,1.75 | smd 0.3 x 1: 9 -1.75,-2.5; 10 -1.25,-2.5; 11 -0.75,-2.5; 12 -0.25,-2.5; 13 0.25,-2.5; 14 0.75,-2.5; 15 1.25,-2.5; 16 1.75,-2.5; 25 1.75,2.5; 26 1.25,2.5; 27 0.75,2.5; 28 0.25,2.5; 29 -0.25,2.5; 30 -0.75,2.5; 31 -1.25,2.5; 32 -1.75,2.5 | smd 3.2 x 3.2: EXP 0,0
SOT363' = smd 0.3 x 0.7: 1 -0.65,-0.8; 2 0,-0.8; 3 0.65,-0.8; 4 0.65,0.8; 5 0,0.8; 6 -0.65,0.8
QFN12 = smd 0.44 x 0.2: P$1 -0.9,0.5; P$2 -0.9,0; P$3 -0.9,-0.5; P$7 0.9,-0.5; P$8 0.9,0; P$9 0.9,0.5 | smd 0.2 x 0.44: P$4 -0.5,-0.9; P$5 0,-0.9; P$6 0.5,-0.9; P$10 0.5,0.9; P$11 0,0.9; P$12 -0.5,0.9 | smd 0.76 x 0.76: P$13 0,0
NX3225 = smd 1.4 x 1.2: 1 -1.1,-0.8; 2 1.1,-0.8; 3 1.1,0.8; 4 -1.1,0.8

### Placement (x,y rotation side)
1V8  70,2 0 bottom
3V3  22,18 0 bottom
C1  16.2,15.39 0 top
C2  13.7,18 90 top
C3  16.1,23.1 0 top
C4  8.3,23.1 180 top
C5  58,12.5 180 bottom
C6  80.16,18.07 0 top
C7  72.2,17.2 180 top
C8  61.61,4.49 90 top
C9  67.5,4.74 270 top
C10  74.75,2.9 0 bottom
C11  66.3,23.2 90 top
C12  79.9,3.3 180 top
C13  74.68,1.4 0 bottom
C14  37.1,21.2 270 bottom
C15  38.2,21.2 270 bottom
C16  38,8.51 270 bottom
C17  36.9,8.52 270 bottom
C18  50.3,14.9 0 top
C19  47.2,11.9 180 top
C20  53.2,13.1 180 top
C21  42.7,22.9 0 top
C22  42.7,19.8 0 top
C23  47,19.1 270 top
C24  50.5,19.1 270 top
C25  54,19.1 270 top
C26  26.83,17.29 180 bottom
C27  29.89,9.68 270 bottom
C28  26.89,9.01 0 bottom
C29  58,19.8 0 top
C30  59.8,19.1 270 top
C31  60.8,19.1 270 top
C32  64.3,19.1 270 top
C33  61.9,11.6 270 top
C34  65.3,19.1 270 top
C35  64.7,10.8 0 top
C36  80.1,21.1 90 top
C37  74.8,21.1 90 top
C39  76.1,21.1 90 top
C40  60.2,10.8 0 top
C41  9.7,5.9 180 top
C42  84.1,21.1 90 top
C44  84.17,16.91 270 top
D1  15.92,21.15 0 top
D2  51.7,24.4 180 top
D3  5,16.3 180 top
GND1  4,11 0 bottom
GND2  12,13 0 bottom
J1  8.7,12.7 270 top
J$1  89.6,10.35 90 top
L1  12,18 270 top
L2  12.4,23.1 90 top
L3  13nH  [0603']  62.5,19.8 0 top
L4  73.51,19.29 90 top
L5  470nH  [0603']  41,20.6 270 top
L6  47nH  [0603']  45.2,19.8 0 top
L7  130nH  [0603']  48.7,19.8 0 top
L8  11nH  [0603']  67,19.8 0 top
L9  78.1,20.2 0 top
L10  82.1,20.2 0 top
L11  100nH  [0603']  52.2,19.8 0 top
L12  56nH  [0603']  55.7,19.8 0 top
L14  220nH  [0603']  67,10.8 180 top
L15  220nH  [0603']  57.8,10.8 180 top
L16  10nH  [0603']  63,11.6 270 top
NRST  20,3 0 bottom
Q1  57.3,2.6 90 top
R1  16.22,13.73 180 top
R2  18.77,17.93 270 top
R3  48.6,24.4 0 top
R4  73.1,14.9 90 top
R5  71,14.2 0 top
R6  25.83,23.17 0 top
R7  23.12,20.56 90 top
R8  49.9,5.8 180 top
R9  52.5,9 270 top
R11  61,22.5 180 top
R12  60.9,23.9 0 top
R13  64.5,22.5 0 top
R14  69.7,6 90 top
R15  59.9,2.6 270 top
R16  54.2,3.3 90 top
R17  31.26,2.58 0 top
R18  29.32,4.95 90 top
R19  80.7,15.2 180 top
R20  80.6,13.6 0 top
R21  47.9,14.9 0 top
R22  40.3,22.9 180 top
R23  23.56,7.21 180 top
RX  6,10 0 bottom
S1  7.1,4 270 top
SWCLK  19,7 0 bottom
SWD  16.08,2.14 90 top
SWDIO  14,10 0 bottom
TX  5,14 0 bottom
U1  16.22,18.14 0 top
U2  DMP3099L-7  [SOT23-3']  7.4,19.9 90 top
U3  76.6,17.5 0 top
U4  26.02,20.52 270 top
U5  XC6221A182MR-G  [SOT23-5']  64.29,4.51 270 top
U6  49.81,8.26 180 top
U7  70.5,22.18 0 top
U8  74.62,5.52 180 top
U9  31.56,4.94 0 top
U10  86.99,3.3 0 top
U11  37.66,19.28 180 top
U12  37.61,6.68 180 top
U13  26.88,13.19 135 top
U14  BGA2818,115  [SOT363']  49.9,12.5 270 top
U$1  84.2,12.9 180 top
V_IN  10,19 0 bottom
V_LNA  46,4 0 bottom
V_PA  74.2,17.4 0 bottom
V_PA_SRC  55,22 0 bottom
X1  36.73,14.59 0 top
X2  36.72,1.99 0 top

### Tracks (layer width: path | path; a pad name or v marks a point on that pad's centre or on a via)
1V8  (via drill 0.25)
  Top 0.152: R17.2 32.84,1.8 v33.3,1.8 | v57.3,1.6 58.25,1.6 Q1.1 59.75,1.65 R15.2 65.9,1.8 66.6,2.5 66.6,5.46
  Top 0.254: U5.5 66.6,5.46 67.5,5.46 C9.1 68.84,6.8 R14.2 70.3,6.8 v70.4,6.7 | U8.P$6 76.62,5.78 76.85,5.55 | 76.85,5.55 76.9,5.5 77.6,5.5 U8.P$3 | U8.P$19 v75.62,2.9 75.62,4.32 v75.7,4.4 76.85,5.55
  Layer2 0.152: v33.3,1.8 57.1,1.8 v57.3,1.6
  Layer2 0.254: v70.4,6.7 v72.5,6.7 73.4,6.7 v75.7,4.4
  Bottom 0.152: v72.5,6.7 72.24,6.44 72.24,4.23 72.23,4.23 1V8.TP
  Bottom 0.254: C13.1 75.4,2.83 C10.1 v75.62,2.9
3.3V  (via drill 0.25)
  Top 0.152: U$1.P$9 U$1.P$8 v82.7,12.9 | v63.1,6.6 63.1,5.56 U5.1 | U4.5 27.25,21.4 v26.3,21.4
  Top 0.254: U6.4 49.16,5.86 R8.2 v49.1,4.9 | U5.1 63.94,5.46 64.3,5.1 64.3,4 63.86,3.56 U5.3 61.82,3.56 C8.1 60.78,4.6 v60,4.6 | U11.8 37.66,22.36 | U12.8 37.61,9.81 v37.7,9.9 38.5,9.9 38.61,9.79 U12.6 | R16.2 54.7,4.6 v54.8,4.6 | v27.55,8.85 27.85,9.15 27.85,9.74 U13.1 | R18.2 29.32,7.08 v29.3,7.1 | U13.17 26.1,16.45 v26.1,17.3 | U13.5 29.92,10.5 v30,10.5 | 38.67,22.07 38.66,22.06 U11.6
  Top 0.406: R22.2 39.1,22.5 | 39.1,22.5 38.67,22.07 | 39.1,22.5 v38.3,22.5 37.8,22.5 37.66,22.36 | L1.2 12,16.1 12.71,15.39 C1.1 15.42,15.27 R1.2
  Top 0.813: R1.2 15.4,13.71 v15.4,13.1
  Layer2 0.152: v63.1,6.6 64.24,7.74 72.17,7.74 73.35,8.92 73.35,12.35 73.7,12.7 82.5,12.7 v82.7,12.9 | v26.3,21.4 26.3,17.5 v26.1,17.3
  Layer2 0.254: v60,4.6 v54.8,4.6 49.4,4.6 v49.1,4.9 | v26.1,17.3 21.1,17.3 20.7,17.7 | 31.95,9.45 30.9,10.5 v30,10.5
  Layer2 0.406: v49.1,4.9 48.7,4.5 40.57,4.5 39.92,5.16 39.92,5.64 40,5.73 40,9.2 39.3,9.9 v37.7,9.9 | v60,4.6 60,5.6 61,6.6 v63.1,6.6
  Layer2 0.813: v15.4,13.1 16.5,12 20.7,12 | 20.7,12 24.4,12 v27.55,8.85 v29.3,7.1 29.6,7.1 31.95,9.45 32.4,9.9 v37.7,9.9 | 20.7,12 20.7,17.7 v20.7,18.6 20.7,19.2 24.7,23.2 37.6,23.2 v38.3,22.5
  Bottom 0.152: C28.1 27.61,8.91 v27.55,8.85
  Bottom 0.254: C17.1 37.99,9.24 C16.1 37.7,9.53 v37.7,9.9 | C26.1 v26.1,17.3 | 3V3.TP 21.4,18.6 v20.7,18.6
  Bottom 0.406: C14.1 C15.1 38.2,22.4 v38.3,22.5 | C27.1 29.91,10.5 v30,10.5
CS1
  Top 0.152: U11.15 33.64,18.28 29.53,14.17 U13.10
CS2  (via drill 0.25)
  Top 0.152: U13.30 23.75,9 v23.2,9 | U12.15 33.52,5.68 31.8,7.4 v31.5,7.4
  Bottom 0.152: v31.5,7.4 29.65,7.4 29.49,7.56 24.64,7.56 v23.2,9
GND  (via drill 0.25)
  other vias: 82.3,9.7 81.1,9.7 80.5,9.7 82.9,9.7 79.9,9.7 79.3,9.7 78.7,9.7 78.1,9.7 77.5,9.7 76.9,9.7 76.3,9.7 75.7,9.7 75.1,9.7 74.5,9.7 73.9,9.7 72.1,9.7 71.5,9.7 70.9,9.7 70.3,9.7 69.7,9.7 69.1,9.7 68.5,9.7 67.9,9.7 67.3,9.7 66.7,9.7 66.1,9.7 65.5,9.7 64.9,9.7 64.3,9.7 63.7,9.7 63.1,9.7 62.5,9.7 61.9,9.7 61.3,9.7 60.7,9.7 60.1,9.7 59.5,9.7 58.9,9.7 58.3,9.7 57.7,9.7 57.1,9.7 56.5,9.7 56,10.1 56,10.7 55.9,11.3 55.5,11.8 55,12 54.4,12.1 53.8,12.1 53.2,12.1 52.6,12.1 52,12.1 51.4,12.1 50.8,12.1 50.8,11.6 51.4,11.6 50.8,12.6 51.4,12.6 49.3,11.2 49.9,11.2 50.5,11.2 51.1,11.2 51.7,11.2 48.1,11 47.5,11 46.9,11 46.3,11 45.7,11 45.1,11 44.5,11 44,11 43.5,11 43.5,10.4 43.5,9.8 43.5,9.2 43.5,8.6 43.5,8 43.5,7.4 43.3,6.7 42.9,6.1 42.3,5.6 41.7,5.4 41.1,5.3 40.5,5.4 40.8,7.2 41.4,7.4 41.7,7.9 41.7,8.5 41.7,9.1 41.7,9.7 41.7,10.3 41.7,10.9 41.7,11.5 41.7,12.1 41.7,12.7 41.7,13.3 41.7,13.9 41.7,14.5 41.7,15.1 41.7,15.7 41.7,16.3 41.7,16.9 41.5,17.4 41.1,17.7 40.6,17.8 42.7,18.9 43.1,18.4 43.4,17.9 43.5,17.3 43.5,16.7 45.3,12.9 45.9,12.9 46.5,12.9 47.1,12.9 47.7,12.9 48.3,12.9 43.5,14.9 43.5,15.5 43.5,16.1 84.6,10.4 84.9,11 82.3,11.9 81.7,11.9 81.1,11.9 80.5,11.9 79.9,11.9 79.3,11.9 78.7,11.9 78.1,11.9 77.5,11.9 76.9,11.9 76.3,11.9 75.7,11.9 75.1,11.9 74.5,11.9 73.9,11.9 68.5,11.9 67.9,11.9 66.7,11.9 66.1,11.9 65.5,11.9 64.9,11.9 64.3,11.9 63.7,11.9 63.1,11.9 62.5,11.9 61.9,11.9 60.7,11.9 60.1,11.9 59.5,11.9 58.9,11.9 57.9,12.1 57.6,12.6 57.2,13.1 56.7,13.5 56.2,13.8 55.6,14.1 55,14.2 54.4,14.2 53.8,14.2 53.2,14.2 52.6,14.2 52,14.2 51.5,13.8 50.9,13.7 50.3,13.7 49.7,13.7 43.3,18.9 43.9,18.9 44.5,18.9 45.1,18.9 45.7,18.9 46.3,18.9 46.9,18.9 47.5,18.9 48.1,18.9 48.7,18.9 49.3,18.9 49.9,18.9 50.5,18.9 51.1,18.9 51.7,18.9 52.3,18.9 52.9,18.9 53.5,18.9 54.1,18.9 54.7,18.9 55.3,18.9 56.5,18.9 57.1,18.9 57.7,18.9 58.3,18.9 58.9,18.9 59.5,18.9 60.1,18.9 60.7,18.9 61.3,18.9 61.9,18.9 62.5,18.9 63.1,18.9 63.7,18.9 64.3,18.9 64.9,18.9 65.5,18.9 66.1,18.9 66.7,18.9 67.3,18.9 67.9,18.9 41.9,20.7 42.5,20.7 43.1,20.7 43.7,20.7 44.3,20.7 44.9,20.7 45.5,20.7 46.1,20.7 46.7,20.7 47.3,20.7 47.9,20.7 48.5,20.7 49.1,20.7 49.7,20.7 50.3,20.7 50.9,20.7 51.5,20.7 52.1,20.7 52.7,20.7 53.3,20.7 53.9,20.7 54.5,20.7 55.1,20.7 56.3,20.7 56.9,20.7 57.5,20.7 58.1,20.7 58.7,20.7 59.3,20.7 59.9,20.7 60.5,20.7 61.1,20.7 61.7,20.7 62.3,20.7 62.9,20.7 63.5,20.7 64.1,20.7 64.7,20.7 65.3,20.7 65.9,20.7 67.1,20.7 67.7,20.7 73.2,21.2 73.8,21.2 74.4,21.2 75,21.2 75.6,21.2 76.2,21.2 76.8,21.2 77.4,21.2 78,21.2 78.6,21.2 79.2,21.2 79.8,21.2 80.4,21.2 81,21.2 81.6,21.2 82.2,21.2 82.8,21.2 83.4,21.2 84,21.2 84.6,21.2 85.2,21.2 85.2,20.6 85.2,20 85.2,19.4 85.2,18.8 85.2,18.2 85.2,17.6 85.2,17 85.2,16.4 85.2,15.7 85.2,15.1 85.2,14.5 83.1,14.5 83.1,15.1 83.1,15.7 83.1,16.3 83.1,16.9 83.1,17.5 83.1,18.1 83.1,18.7 82.7,19.2 82.1,19.2 81.5,19.2 80.9,19.2 80.3,19.2 79.7,19.2 79.1,19.2 78.5,19.2 77.9,19.2 77.3,19.2 76.7,19.2 76.1,19.2 75.5,19.2 74.9,19.2 74.3,19.2 73.7,19.2 73.1,19.2 76.6,17.5 76.6,18.4 76.6,16.6 76,18.4 76,17.5 76,16.6 77.2,16.6 77.2,17.5 77.2,18.4 18,15.8 18,15.1 16.2,18.2 17.2,18.2 16.7,18.2 18.8,19.6 59.1,23.3 58.2,23.3 70.5,21.6 70.5,22.1 70.5,22.6 70.5,23.1 70.5,23.6 70.5,24.1 70.5,24.6 71,21.6 71,22.1 71,22.6 71,23.1 71,23.6 71,24.1 71,24.6 70,24.6 70,24.1 70,23.6 70,23.1 70,22.6 70,22.1 70,21.6 87.8,11.6 88.4,11.6 89,11.6 89.6,11.6 90.2,11.6 90.8,11.6 91.4,11.6 89,20 89,18 91,24 91,20 91,18 90.8,16 89,16 89,14.2 78.9,14 78.9,13.3 87,24 87,22 84.2,24.4 82.2,24.4 80.2,24.4 78.2,24.4 76.2,24.4 74.2,24.4 72.2,24.4 82,1.6 79,1 77,1 73,1 71,1 69,1 67,1 65,1 63,1 61,1 1,1 3,1 5,1 9,1 11,1 18,1 20,1 21,1 23,1 25,1 27,1 1,3 1,7 1,9 1,11 1,14 1,16 1,18 1,22 1,24 3,24 5,24 3,16 3,14 3,11 3,9 5,9 5,7 3,3 5,3 7,5 7,3 9,3 12,3 14,3 9,5 12,5 14,5 12,7 7,7 12,9 14,9 52,17 50,17 48,17 54,17 56,17 60,17 62,17 64,17 66,17 52,15 54,15 56,15 58,15 60,15 83.9,13.2 72.4,11.9 26.9,13.2 27.8,12.2 25.9,14.2 25,13.2 26.9,15.1 26.9,11.3 28.8,13.2 25.9,12.3 27.8,14.1 37.6,6.7 37.6,5.8 37.6,7.6 38.4,7.6 38.4,6.8 38.4,5.8 36.8,5.8 36.8,6.7 36.8,7.6 37.7,19.3 37.7,18.4 37.7,20.2 38.6,20.2 38.6,19.3 38.6,18.4 36.8,18.4 36.8,19.3 36.8,20.2 61.3,11.9 5,22 9,18 9,20 11,18 81.7,9.7 16.2,17.7 16.2,17.2 35,12 36,12 38,12 40,12 40,14 38,14 40,16 57,1 55,1 53,1 51,1 49,1 47,1 45,1 43,1 41,1 39,1 19,24 20,24 19,22 45,23 47,23 49,23 62,15 64,15 66,15 68,15 66,13 60,13 60,7 58,7 66,7 75,7 73,5 82,7 82,9 82,8 82,6 82,5 81,2.2 84.6,9.7 85.2,9.7 85.8,9.7 87.6,9.7 88.2,9.7 88.8,9.7 89.4,9.7 90,9.7 90.6,9.7 91.2,9.7 89.6,16 90.2,16 88.4,16 87.8,16 88.4,14.2 87.8,14.2 89.6,14.2 90.2,14.2 83.5,9.7 84.1,9.7 82,8.5 82,7.5 82,6.5 82,5.5 82,4.5 82,2.2 78,4.5 78.6,4.5 79.2,4.5 79.8,4.5 80.4,4.5 80.4,2.2 79.8,2.2 79.2,2.2 78.6,2.2 78,2.2 77.4,2.2 77.4,4.5 76.8,4.5 76.8,2.2 76.8,3.9 76.8,3.3 76.8,2.8 86.4,9.7 87,9.7 81,4.5 81.5,4.5 81.5,2.2 82,1 30.8,4.8 14,7 82.9,11.9 83.5,11.8 90.8,14.2 91.4,14.2 87.2,11.8 86.6,11.8 86,11.8 85.4,12 84.9,12.3 87.2,14 86.6,14 86,14 85.5,13.8 85,13.5 91.4,16 84.5,13.2 83.9,12.6 84.5,12.6 72.7,9.7 73.9,3.8 73,1.6 68,13 55.9,18.9 72.9,11.9 44.7,12.9 44.1,12.9 43.5,12.9 43.5,14.3 43.5,13.7 58.4,11.9
  pour Top (isolate 0.2, no thermals): -1,26 93.2,26 93.2,-0.9 -1,-0.9
  pour Bottom (isolate 0.2, no thermals): -3,28 95,28 95,-3 -3,-3
  pour Layer3 (isolate 0.2): -1.6,27 93.8,27 93.8,9.4 82.3,9.4 82.3,-2.4 -1.6,-2.4
GNSS_1PPS  (via drill 0.25)
  Top 0.152: U8.P$11 70.48,7.52 69.8,8.2 57.3,8.2 56.2,7.1 v55.7,7.1 | v31.6,5 31.56,5.04 U9.5
  Bottom 0.152: v55.7,7.1 51,2.4 33.2,2.4 31.6,4 v31.6,5
GNSS_NMEA_RX  (via drill 0.25)
  Top 0.152: U13.9 30.48,14.32 30.88,14.32 32.4,12.8 v32.4,8 | v50.3,3 53.8,3 R16.1
  Top 0.254: Q1.3 R16.1
  Layer2 0.152: v32.4,8 35.1,5.3 v35.1,4.6
  Bottom 0.152: v35.1,4.6 35.2,4.7 40.5,4.7 42.4,2.8 50.1,2.8 v50.3,3
GNSS_UART_TX  (via drill 0.25)
  Top 0.152: U8.P$15 69.02,3.52 v67.8,2.3 | Q1.2 59.65,3.55 R15.1
  Bottom 0.152: v67.8,2.3 60.9,2.3 R15.1
  other vias: 59.9,3.3
LNA_IN
  Top 0.406: U$1.P$11 84.2,11.2 arc-90 83.8,10.8 83.2,10.8
  Top 1.2: L14.1 83.2,10.8
LNA_OUT
  Top 0.254: U11.2 40.72,18.78 arc-90 40.8,18.7 | 40.9,6.2 39.68,6.2 arc90 U12.2
  Top 0.813: 40.8,18.7 arc-90 42.6,16.9 42.6,12 | 40.9,6.2 arc90 42.6,7.9 42.6,12 | C19.2 42.7,11.9 42.6,12
MCU_GNSS_1PPS
  Top 0.152: U13.8 29.96,12.66 30.5,13.2 31.2,13.2 31.76,12.64 31.76,9.53 31,8.77 31,5.84 U9.6 30.74,5.9 30.4,5.9 30.1,5.6 30.1,4.5 30,4.4 29.47,4.4 R18.1
MCU_UART_RX
  Top 0.152: U13.20 24.42,16 22.1,16 17.53,11.43 J1.3
  Bottom 0.152: J1.3 7.27,10 RX.TP
MCU_UART_TX
  Top 0.152: U13.19 24.73,16.4 21.87,16.4 17.27,11.8 11.4,11.8 9.23,13.97 J1.2
  Bottom 0.152: TX.TP 8.67,14 J1.2
MISO  (via drill 0.25)
  Top 0.152: U11.13 33.82,19.28 v33.8,19.3 | v32.4,19.3 31,17.9 31,16.96 U13.12 | U12.13 34.12,6.68 33.5,7.3 33.5,16.74 v33.8,17.04
  Layer2 0.152: v32.4,19.3 v33.8,19.3 v33.8,17.04
MOSI  (via drill 0.25)
  Top 0.152: U11.14 33.18,18.78 v33.15,18.75 | U13.13 30.4,17.06 30.4,18.1 v31.1,18.8 | U12.14 33.82,6.18 33,7 33,16.94 v33.1,17.04
  Layer2 0.152: v31.1,18.8 33.1,18.8 v33.15,18.75 33.1,18.7 v33.1,17.04
N$1
  Top 0.406: C3.1 16.22,22.08 U1.5 U1.4
  Top 0.61: L2.2 C3.1
N$2
  Top 0.406: D1.C 14.95,21.15 15.27,20.82 U1.6 14.27,19.29 C2.2 12.18,18.72 L1.1
N$3
  Top 0.61: R3.2 D2.A
N$4
  Top 0.406: C2.1 14.98,17.28 U1.1
N$5
  Top 0.152: U1.3 18.63,16.99 R2.2 18.77,14.37 18.13,13.73 R1.1
N$6
  Top 0.152: U6.5 U6.6 50.46,5.94 R8.1
N$7
  Top 0.152: R7.2 24.62,21.36 U4.1 24.73,22.77 R6.1
N$8
  Top 0.254: R12.2 R11.1 R13.1
N$9
  Top 0.254: R4.1 73.8,14.2 74.2,14.6 74.2,17.1 74.6,17.5 U3.P$2
  Top 0.406: R5.2 R4.1
N$10
  Top 0.152: U8.P$1 78.88,3.52 C12.2
N$11
  Top 0.254: U10.P$1 C12.1
N$12
  Top 0.152: U9.3 U9.2 31.56,3.58 R17.1
N$13
  Top 0.254: R14.1 69.92,5.52 U8.P$13
N$14
  Top 0.152: R19.1 R20.2 82,13.6 82.2,13.4 U$1.P$7
N$15
  Top 0.406: U$1.P$2 85.6,12.9
  Top 0.61: 85.6,12.9 86.1,12.9
  Top 1.2: J$1.SIG 86.1,12.9
N$16
  Top 0.152: X2.1 35.84,1.19 36.61,1.96 U12.16
N$17
  Top 0.152: U12.17 37.11,3.5 X2.3
N$18
  Top 0.152: X1.1 35.75,13.79 36.66,14.7 U11.16
N$19
  Top 0.152: U11.17 37.16,16.06 X1.3
N$20
  Top 0.254: U14.6 52.43,13.15 C20.2
N$22
  Top 0.254: U14.1 49.1,14.5 48.85,14.75 | 48.85,14.75 R21.2 | C18.1 49.43,14.75 48.85,14.75
N$23
  Top 0.61: L4.2 | C37.1
  Top 1: U7.3 L4.2 | L4.2 C37.1 | C37.1 C39.1 L9.1
N$24
  Top 0.254: U11.4 39.73,19.8 41.08,19.8
  Top 0.406: C22.1 41.08,19.8 L5.2
N$25
  Top 0.508: U7.1 68.6,19.8 L8.2
N$26
  Top 0.254: R13.2 C11.1
  Top 0.406: L3.2 C32.1 C34.1 66.25,19.82 L8.1 66.28,20.25 66.48,20.46 66.48,20.94 66.3,21.13 C11.1
N$27
  Top 0.406: L3.1 61.75,19.82 C31.1 C30.1 C29.2
N$28
  Top 1: L9.2 C36.1 L10.1
N$30
  Top 0.406: C21.1 R22.1 L5.1
N$31
  Top 0.406: L6.1 C22.2
N$32
  Top 0.406: L7.1 C23.1 L6.2
N$33
  Top 0.406: L11.1 C24.1 49.45,19.82 L7.2
N$34
  Top 0.406: L12.1 C25.1 52.95,19.82 L11.2
N$36
  Top 0.152: U13.31 24.26,8.8 R23.1
N$37
  Top 0.508: C40.2 C33.2 L16.2 C35.1
N$38
  Top 0.508: L15.1 C40.1
N$39
  Top 0.508: C35.2 L14.2
N$40
  Top 0.254: C20.1 54.5,13.1
  Top 1: 54.5,13.1 54.78,13.1
  Top 1.2: 54.78,13.1 arc-90 L15.2
N$41
  Top 0.254: U14.3 47.97,11.85 C19.1
N$43
  Top 0.61: C42.1 84.17,20.13
  Top 1.2: L10.2 C42.1 | 84.17,20.13 C44.1
NRST  (via drill 0.25)
  Top 0.152: U13.4 29.2,10.52 29.2,7.8 26,4.6 v21.2,4.6 | S1.3 S1.4 | S1.4 12.2,1.85 15.03,4.68 SWD.2 | S1.4 11.59,1.46 11.46,1.59 11.46,3.19 10.4,4.25 C41.1
  Bottom 0.152: SWD.2 16.16,4.6 v21.2,4.6 20,3.4 NRST.TP
PA_IN
  Top 0.406: C29.1 L12.2
PA_OUT
  Top 0.406: 84.2,14.8 U$1.P$5
  Top 1.2: C44.2 84.2,15.98 84.2,14.8
RFSW_CTRL  (via drill 0.25)
  Top 0.152: U6.2 49.81,8.39 50,8.2 R9.2 v55.8,8.2 56.37,8.2 56.87,8.71 v70.5,8.71 v70.5,8.7 | U13.2 27.76,10.47 28.21,10.03 28.21,8.11 25.6,5.5 v25.6,5.3 | v78.3,14.8 78.7,15.2 R19.2
  Bottom 0.152: v70.5,8.7 72.9,8.7 73.34,9.14 73.34,12.99 73.61,13.26 76.76,13.26 v78.3,14.8 | v25.6,5.3 25.6,4 28.3,1.3 34,1.3 34.65,1.95 56.35,1.95 57,2.6 57,7.1 55.9,8.2 v55.8,8.2
RX_IC_CLK  (via drill 0.25)
  Top 0.152: U12.20 v38.61,3.99 v38.62,3.98 | U13.26 22.88,10.96 v21.7,10.96 | v22.92,3.98 27.68,3.98 v27.7,4
  Layer2 0.152: v21.7,10.96 21.7,5.2 v22.92,3.98 | v27.7,4 38.6,4 v38.62,3.98
RX_IC_DATA  (via drill 0.25)
  Top 0.152: U13.27 23.13,10.5 v21,10.5 | U12.10 35.43,8.73 v35,8.3
  Bottom 0.152: v35,8.3 35,7.4 33.36,5.76 20.84,5.76 20.4,6.2 20.4,9.9 v21,10.5
SCK  (via drill 0.25)
  Top 0.152: U12.12 34.42,7.18 34.1,7.5 34.1,16.69 v34.41,17 | U13.11 32.18,17.43 32.18,18.43 33.55,19.8 v34.6,19.8 34.62,19.78 U11.12
  Layer2 0.152: v34.41,17 34.41,19.61 v34.6,19.8
SDN1  (via drill 0.25)
  Top 0.152: U13.14 29.7,17.07 v29.7,17.5 | U11.1 v39.71,17.51 v39.7,17.5
  Bottom 0.152: v29.7,17.5 v39.7,17.5
SDN2  (via drill 0.25)
  Top 0.152: U13.25 22.82,11.6 21.3,11.6 20.5,10.8 20.5,4.4 21.6,3.3 v29.5,3.3 | U12.1 39.66,3.96 v39.6,3.9
  Layer2 0.152: v29.5,3.3 39,3.3 v39.6,3.9
SWCLK
  Top 0.152: U13.24 22.45,12.3 20.8,12.3 19.1,10.6 19.1,7.9 18.42,7.22 SWD.3
  Bottom 0.152: SWCLK.TP 16.3,7 SWD.3
SWDIO
  Top 0.152: U13.23 23.6,14.7 22.2,14.7 17.26,9.76 SWD.4
  Bottom 0.152: SWD.4 14.24,9.76 SWDIO.TP
TRX_IC_CLOCK  (via drill 0.25)
  Top 0.152: U13.7 30.14,11.7 30.74,11.7 30.8,11.76 v30.8,12.16 | U11.19 38.16,16.46 v38.1,16.4
  Bottom 0.152: v38.1,16.4 34.84,16.4 30.8,12.36 v30.8,12.16
TRX_IC_DATA
  Top 0.152: U13.15 29.1,17.18 29.1,18.9 31.53,21.33 U11.10
TX_CTRL  (via drill 0.25)
  Top 0.152: U13.29 23.84,9.8 v22.8,9.8
  Layer2 0.152: v44.1,21.8 56.35,21.8 57.05,22.5 R11.2
  Bottom 0.152: v44.1,21.8 43.1,22.8 39.18,22.8 38.93,22.55 38.93,21.3 38.8,21.17 36.51,21.17 36.48,21.2 28.3,21.2 22.2,15.1 22.2,10.4 v22.8,9.8
  other vias: 60.2,22.5
V_BAT  (via drill 0.25)
  Top 0.406: U2.2 8.85,20.85
  Top 0.61: 8.85,20.85 9.6,21.6 | 9.6,21.6 9.9,21.9 C4.1 L2.1 | 9.6,21.6 10,21.2 v10.3,21.2
  Layer2 0.61: v18.6,20.5 22.5,24.4 R3.1
  Bottom 0.61: v10.3,21.2 11,20.5 v18.6,20.5
  other vias: 47.9,24.4
V_IN
  Top 0.406: J1.1 5.93,16.51 D3.1 5.72,19.22 U2.3
  Bottom 0.508: V_IN.TP 10,17.81 J1.1
V_LNA  (via drill 0.25)
  Top 0.254: U6.3 49.16,9.94 v49.1,10 | v47.2,14.1 R21.1
  Bottom 0.152: v49.1,10 48.6,10 47.8,9.2 47.8,4.8 47,4 V_LNA.TP
  Bottom 0.254: v49.1,10 49.1,10.68 48.79,10.99 48.79,11.41 49,11.62 49,13 48.1,13.9 47.2,13.9 v47.2,14.1
V_PA  (via drill 0.25)
  Top 0.406: U3.P$1 75.04,18.39 | C7.1 72.99,17.26
  Top 0.61: R4.2 73.1,17.15 72.99,17.26 73.51,17.78 L4.1 73.57,18.45 U3.P$1
  Bottom 0.254: C7.1 V_PA.TP
  other vias: 72.9,17.2
V_PA_SRC  (via drill 0.25)
  Top 0.152: R6.2 28.03,23.17 28.9,22.3 v29.4,22.3
  Top 0.406: U3.P$6 78.1,18 | 78.1,18 U3.P$5 | C6.1 78.17,18.07 78.1,18
  Top 0.61: D2.C v55.7,24.4
  Bottom 0.152: v29.4,22.3 30.7,23.6 55,23.6 | v55.7,24.4 55,23.7 55,23.6 | V_PA_SRC.TP 55,23.6
  Bottom 0.61: C6.1 77.86,16.67 77.86,16.33 77.23,15.7 70.5,15.7 | v55.7,24.4 67.4,24.4 69.14,22.66 69.14,21.23 70.5,19.87 70.5,15.7 | 70.5,15.7 C5.P$3
  other vias: 79.46,18.07
V_PA_SRC_DIV  (via drill 0.25)
  Top 0.152: U13.6 29.93,11.2 v30.7,11.2 | U4.3 U4.4 27.35,19.6 28.2,19.6 v28.3,19.5
  Layer2 0.152: v30.7,11.2 32.41,12.91 32.41,16 28.81,19.6 28.4,19.6 v28.3,19.5
(copper drawn outside any net)
  shapes: Top area x10

### Text on the board
tNames: AIS Transponder / Class B / Rev 5.0 / (c)2016-2020 / P. Antypas
bNames: JLCJLCJLCJLC